# EasyEDA Pro project Secuenciador.eprj

# Schematic MAIN
Board Name: Board1; Create Date: 2025-08-13; Page Name: P1; Project Name: Secuenciador; Schematic Name: MAIN; Update Date: 2025-08-21; Company: EasyEDA.com; Page Size: A4; Version: V1.0
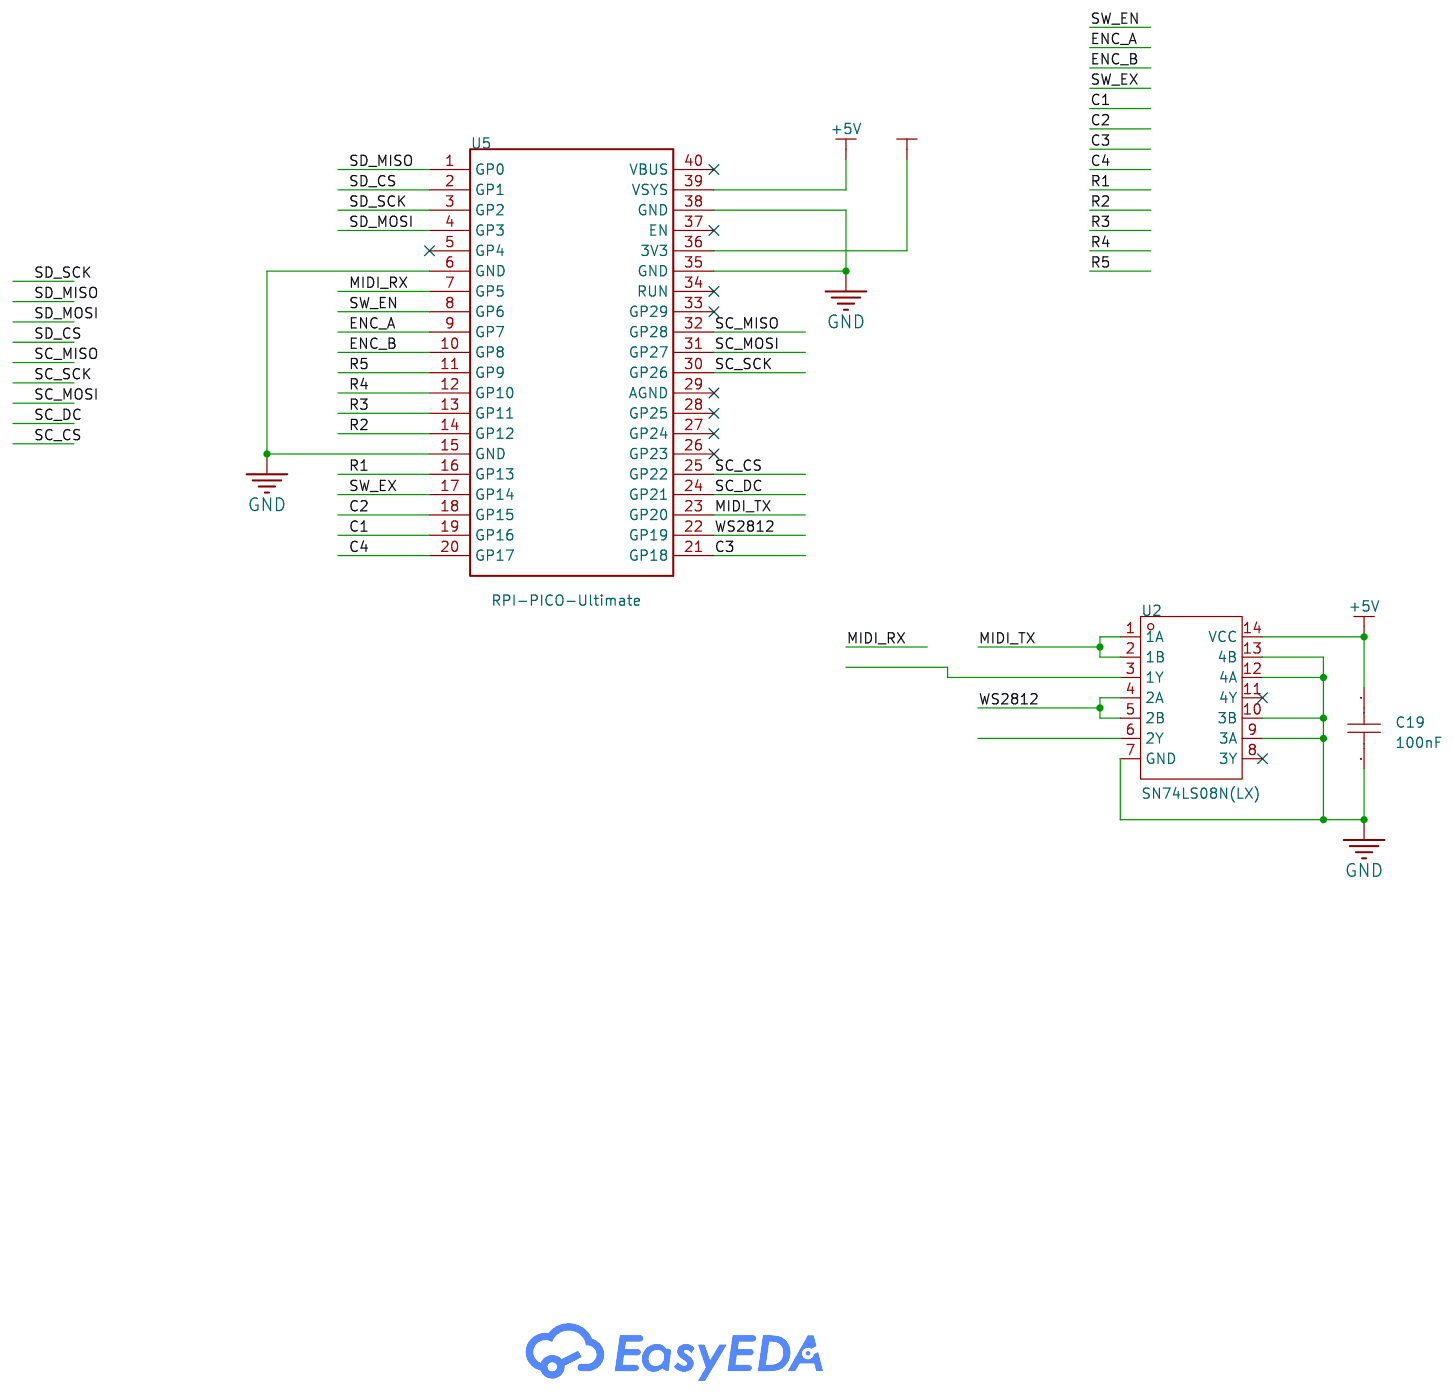
[diagram p0: schematic sheet]

## Parts
C19  100nF  [C0805]
CBB1  -
CBB2  -
CBB3  -
CBB4  -
U2  SN74LS08N(LX)  [DIP-14_L19.1-W6.4-P2.54-LS7.6-BL]
U5  RPI-PICO-Ultimate  [RP-Pico-Ultimate-FP]

## Library data of the parts
C19 = C0805B104K500NT: LCSC Part Name: 100nF ±10% 50V; Supplier Part: C476766; Manufacturer: TORCH(火炬); Supplier Footprint: 0805; JLCPCB Part Class: Extended Part; Datasheet: https://atta.szlcsc.com/upload/public/pdf/source/20191230/C476766_171E30D5B7F7164A8210B8E948DFBAE0.pdf; Supplier: LCSC; Tolerance: ±10%; Voltage Rating: 50V; Temperature Coefficient: X7R
U2 = SN74LS08N(LX): LCSC Part Name: 集成电路; Supplier Part: C22384768; Manufacturer: LX(灵星芯微); Supplier Footprint: DIP-14; JLCPCB Part Class: Extended Part; Datasheet: https://item.szlcsc.com/datasheet/SN74LS08N(LX)/23931745.html; Supplier: LCSC; Logic Type: AND Gate; Number of Channels: 4; Voltage - Supply: 2V~6V; Quiescent Current: 2uA; Current - Output Low(IOL): 5.2mA; Current - Output High(IOH): 5.2mA; Input Logic Level - High: 1.5V~4.2V; Input Logic Level - Low: 500mV~1.8V; Series: 74LS Series; Propagation Delay: 15ns@6V; Operating Temperature: -40℃~+125℃
U5 = RPI-PICO-Ultimate: Manufacturer: Raspberry Pi Foundation; Mounting Technology: SMT; Supplier: DigiKey; Supplier Part No: 2648-SC0915CT-ND; Supplier Link: https://www.digikey.com/en/products/detail/raspberry-pi/SC0915/13684020; Manufacturer Part No: SC0915

## Nets
+3V3RP: U5.36(3V3)
+5V: C19.1 U2.14(VCC) U5.39(VSYS)
GND: C19.2 U2.7(GND) U2.9(3A) U2.10(3B) U2.12(4A) U2.13(4B) U5.6(GND) U5.15(GND) U5.35(GND) U5.38(GND)
C1: CBB1.(SW_EX) U5.8(GP6) U5.9(GP7) U5.10(GP8) U5.11(GP9) U5.12(GP10) U5.13(GP11) U5.14(GP12) U5.16(GP13) U5.17(GP14) U5.18(GP15) U5.19(GP16) U5.20(GP17) U5.21(GP18)
MIDI_RX: CBB4.(MIDI_RX) U2.3(1Y) U5.7(GP5)
MIDI_TX: U2.1(1A) U2.2(1B) U5.23(GP20)
SC_CS: CBB3.(SD_SCK) U5.1(GP0) U5.2(GP1) U5.3(GP2) U5.4(GP3) U5.24(GP21) U5.25(GP22) U5.30(GP26) U5.31(GP27) U5.32(GP28)
WS2812: U2.4(2A) U2.5(2B) U5.22(GP19)
Net-(CBB2-): CBB2.(WS2812) U2.6(2Y)

Not connected (* = marked no-connect by the designer): U2 8(3Y)* 11(4Y)*; U5 5(GP4)* 26(GP23)* 27(GP24)* 28(GP25)* 29(AGND)* 33(GP29)* 34(RUN)* 37(EN)* 40(VBUS)*

# Schematic MIDI
Create Date: 2025-08-13; Page Name: P1; Project Name: Secuenciador; Schematic Name: MIDI; Update Date: 2025-08-22; Company: EasyEDA.com; Page Size: A4; Version: V1.0
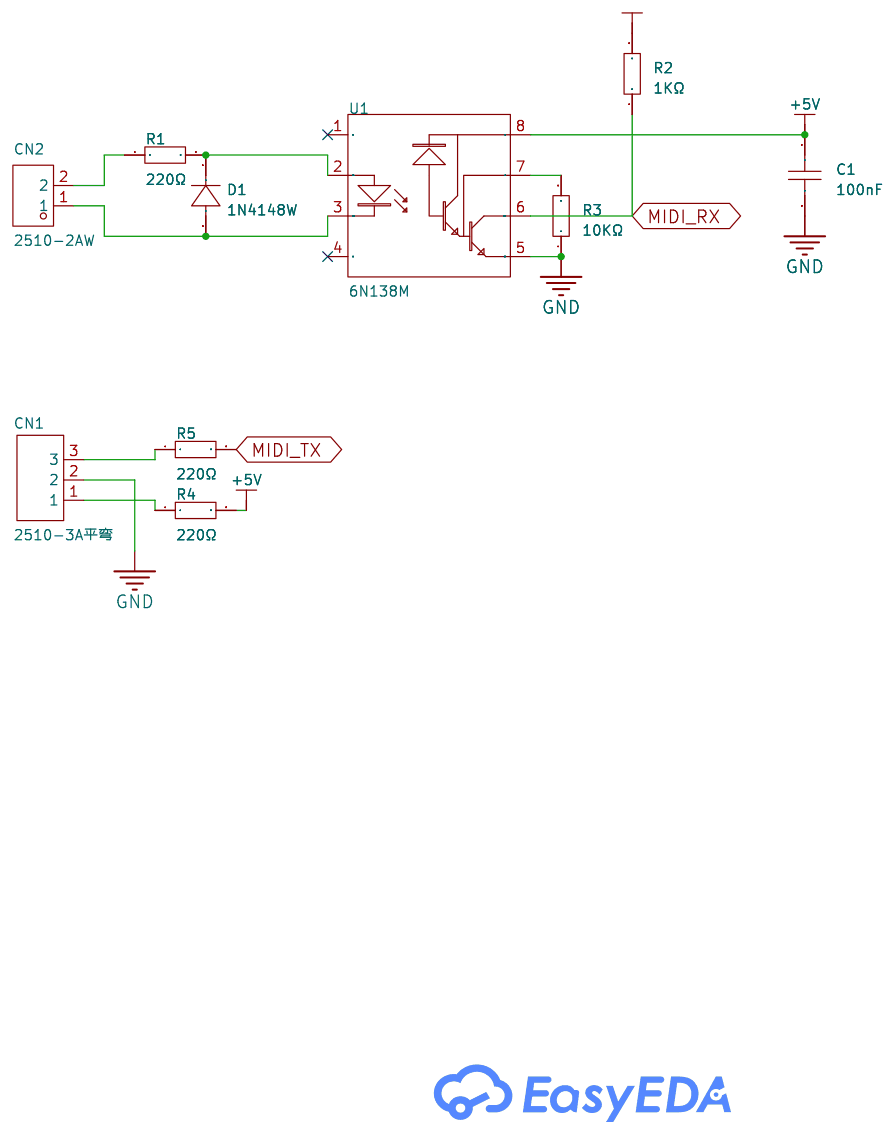
[diagram p1: schematic sheet]

## Parts
C1  100nF  [C0805]
CN1  2510-3A平弯  [CONN-TH_KF2510-3AW]
CN2  2510-2AW  [CONN-TH_2510-2AW]
D1  1N4148W  [SOD-123_L2.8-W1.8-LS3.7-RD-1]
R1  220Ω  [R1210]
R2  1KΩ  [R1210]
R3  10KΩ  [R1210]
R4  220Ω  [R1210]
R5  220Ω  [R1210]
U1  6N138M  [DIP-8_L9.8-W6.6-P2.54-LS7.6-BL]

## Library data of the parts
C1 = CAP_0805: Supplier Footprint: 0805
CN1 = 2510-3A平弯_C45011: LCSC Part Name: 1x3P 间距:2.54mm 弯插 系列:KK 254(MX2510); Supplier Part: C45011; Manufacturer: BOOMELE(博穆精密); Supplier Footprint: 弯插,P=2.54mm; JLCPCB Part Class: Extended Part; Datasheet: https://item.szlcsc.com/datasheet/2510-3A%25E5%25B9%25B3%25E5%25BC%25AF/46013.html; Supplier: LCSC; Pins Structure: 1x3P; Pitch: 2.54mm; Mounting Type: Right Angle; Reference Series: KK 254(MX2510); Number of Pins: 3P; Number of Rows: 1; Number of PINs Per Row: 3
CN2 = 2510-2AW: LCSC Part Name: 1x2P 间距:2.54mm 弯插; Supplier Part: C722717; Manufacturer: CAX(创都); Supplier Footprint: 弯插,P=2.54mm; JLCPCB Part Class: Extended Part; Datasheet: https://item.szlcsc.com/datasheet/2510-2AW/766924.html; Supplier: LCSC; Pins Structure: 1x2P; Pitch: 2.54mm; Mounting Type: Right Angle; Number of Pins: 2P; Number of Rows: 1; Number of PINs Per Row: 2; Current Rating: 3A; Operating Temperature: -25℃~+85℃
D1 = 1N4148W_C917030: Supplier Part: C917030; Manufacturer: JSMSEMI(杰盛微); Supplier Footprint: SOD-123; JLCPCB Part Class: Extended Part; Datasheet: https://item.szlcsc.com/datasheet/1N4148W/991526.html; Supplier: LCSC; Diode Configuration: Independent; Voltage - Forward(Vf@If): 1.25V@150mA; Voltage - DC Reverse(Vr): 100V; Current - Rectified: 300mA; Pd - Power Dissipation: 400mW; Reverse Leakage Current (Ir): 1uA@75V; Reverse Recovery Time (trr): 8ns; Operating Junction Temperature Range: -55℃~+150℃@(Tj); Non-Repetitive Peak Forward Surge Current: 4A
R1-R5 = Res_1210: Supplier Footprint: 1210
U1 = 6N138M: Supplier Part: C3001991; Manufacturer: UMW(友台半导体); Supplier Footprint: DIP-8; JLCPCB Part Class: Extended Part; Datasheet: https://item.szlcsc.com/datasheet/6N138M/3486698.html; Supplier: LCSC; Input Type: DC; Voltage - Supply: -500mV~18V; Isolation Voltage(Vrms): 5kV; CMTI(kV/us): 1kV/us; Current transfer ratio: 300%; Number of Channels: 1; Operating Temperature: -55℃~+100℃; Low level Delay Time: 35us; High level Delay Time: 15us; Output current: 60mA; power dissipation: 200mW; Output voltage: 18V; Voltage - Forward(Vf): 1.28V

## Nets
+3V3RP: R2.2
+5V: C1.1 R4.2 U1.8(VCC)
GND: C1.2 CN1.2 R3.1 U1.5(EMITTER)
MIDI_RX: R2.1 U1.6(COLLECTOR)
MIDI_TX: R5.2
Net-(CN1-1): CN1.1 R4.1
Net-(CN1-3): CN1.3 R5.1
Net-(CN2-1): CN2.1 D1.2(A) U1.3(CATHODE)
Net-(CN2-2): CN2.2 R1.1
Net-(D1-1): D1.1(C) R1.2 U1.2(ANODE)
Net-(R3-2): R3.2 U1.7(VB)

Not connected (* = marked no-connect by the designer): U1 1(NC)* 4(NC)*

# Schematic INPUT
Create Date: 2025-08-13; Page Name: P1; Project Name: Secuenciador; Schematic Name: INPUT; Update Date: 2025-08-15; Company: EasyEDA.com; Page Size: A4; Version: V1.0
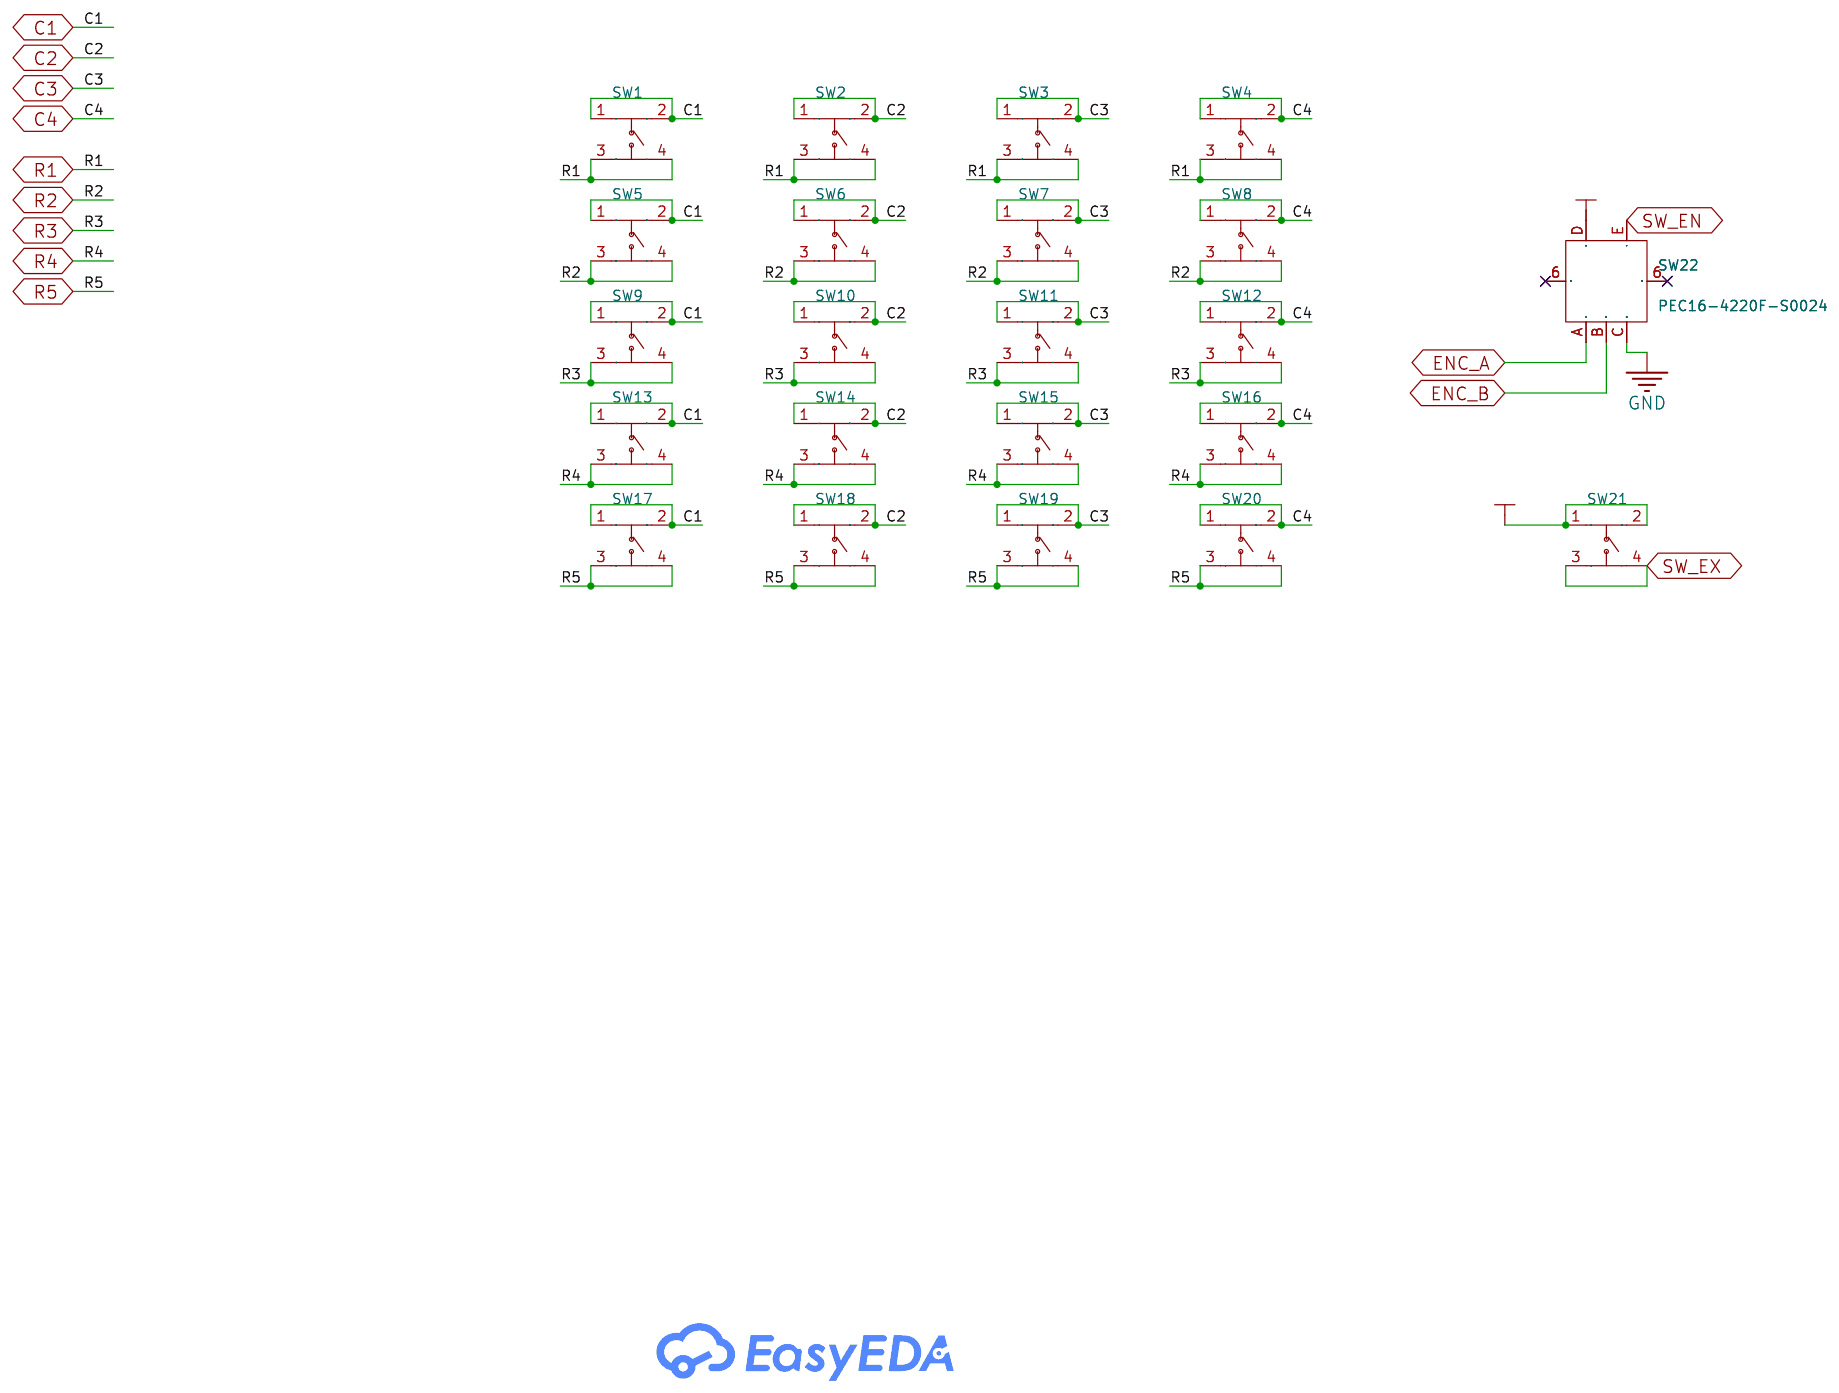
[diagram p2: schematic sheet]

## Parts
SW1  K2-1103DP-Y4SW-04  [KEY-TH_4P-L12.0-W12.0-P5.00-LS12.5]
SW2  K2-1103DP-Y4SW-04  [KEY-TH_4P-L12.0-W12.0-P5.00-LS12.5]
SW3  K2-1103DP-Y4SW-04  [KEY-TH_4P-L12.0-W12.0-P5.00-LS12.5]
SW4  K2-1103DP-Y4SW-04  [KEY-TH_4P-L12.0-W12.0-P5.00-LS12.5]
SW5  K2-1103DP-Y4SW-04  [KEY-TH_4P-L12.0-W12.0-P5.00-LS12.5]
SW6  K2-1103DP-Y4SW-04  [KEY-TH_4P-L12.0-W12.0-P5.00-LS12.5]
SW7  K2-1103DP-Y4SW-04  [KEY-TH_4P-L12.0-W12.0-P5.00-LS12.5]
SW8  K2-1103DP-Y4SW-04  [KEY-TH_4P-L12.0-W12.0-P5.00-LS12.5]
SW9  K2-1103DP-Y4SW-04  [KEY-TH_4P-L12.0-W12.0-P5.00-LS12.5]
SW10  K2-1103DP-Y4SW-04  [KEY-TH_4P-L12.0-W12.0-P5.00-LS12.5]
SW11  K2-1103DP-Y4SW-04  [KEY-TH_4P-L12.0-W12.0-P5.00-LS12.5]
SW12  K2-1103DP-Y4SW-04  [KEY-TH_4P-L12.0-W12.0-P5.00-LS12.5]
SW13  K2-1103DP-Y4SW-04  [KEY-TH_4P-L12.0-W12.0-P5.00-LS12.5]
SW14  K2-1103DP-Y4SW-04  [KEY-TH_4P-L12.0-W12.0-P5.00-LS12.5]
SW15  K2-1103DP-Y4SW-04  [KEY-TH_4P-L12.0-W12.0-P5.00-LS12.5]
SW16  K2-1103DP-Y4SW-04  [KEY-TH_4P-L12.0-W12.0-P5.00-LS12.5]
SW17  K2-1103DP-Y4SW-04  [KEY-TH_4P-L12.0-W12.0-P5.00-LS12.5]
SW18  K2-1103DP-Y4SW-04  [KEY-TH_4P-L12.0-W12.0-P5.00-LS12.5]
SW19  K2-1103DP-Y4SW-04  [KEY-TH_4P-L12.0-W12.0-P5.00-LS12.5]
SW20  K2-1103DP-Y4SW-04  [KEY-TH_4P-L12.0-W12.0-P5.00-LS12.5]
SW21  K2-1103DP-Y4SW-04  [KEY-TH_4P-L12.0-W12.0-P5.00-LS12.5]
SW22  PEC16-4220F-S0024  [SW-SMD_PEC16-4220F-S0024]

## Library data of the parts
SW1-SW21 = K2-1103DP-Y4SW-04: LCSC Part Name: 12x12x18插件开关; Supplier Part: C2909667; Manufacturer: 韩国韩荣; Supplier Footprint: 插件; JLCPCB Part Class: Extended Part; Datasheet: https://atta.szlcsc.com/upload/public/pdf/source/20211126/1EEB0C2A8EBA15EDA0FBF5A1B503683D.pdf; Supplier: LCSC; Actuator Style: Round Button; Operating Force: 250gf; Mounting Style: Straight; Switch Length: 12mm; Switch Width: 12mm; Switch Height: 17mm; Contact Current: 50mA; Voltage Rating (DC): 12V; Insulation Resistance: 100MΩ; Mechanical Life: 10万次; Operating Temperature: -25℃~+85℃
SW22 = PEC16-4220F-S0024: LCSC Part Name: 三件套 PEC16-4220F-S0024（三件套）; Supplier Part: C143796; Manufacturer: BOURNS; Supplier Footprint: 插件; JLCPCB Part Class: Extended Part; Datasheet: https://item.szlcsc.com/datasheet/PEC16-4220F-S0024/155127.html; Supplier: LCSC

## Nets
+3V3RP: SW21.1 SW21.2 SW22.D
GND: SW22.C
C1: SW1.1 SW1.2 SW5.1 SW5.2 SW9.1 SW9.2 SW13.1 SW13.2 SW17.1 SW17.2
C2: SW2.1 SW2.2 SW6.1 SW6.2 SW10.1 SW10.2 SW14.1 SW14.2 SW18.1 SW18.2
C3: SW3.1 SW3.2 SW7.1 SW7.2 SW11.1 SW11.2 SW15.1 SW15.2 SW19.1 SW19.2
C4: SW4.1 SW4.2 SW8.1 SW8.2 SW12.1 SW12.2 SW16.1 SW16.2 SW20.1 SW20.2
ENC_A: SW22.A
ENC_B: SW22.B
R1: SW1.3 SW1.4 SW2.3 SW2.4 SW3.3 SW3.4 SW4.3 SW4.4
R2: SW5.3 SW5.4 SW6.3 SW6.4 SW7.3 SW7.4 SW8.3 SW8.4
R3: SW9.3 SW9.4 SW10.3 SW10.4 SW11.3 SW11.4 SW12.3 SW12.4
R4: SW13.3 SW13.4 SW14.3 SW14.4 SW15.3 SW15.4 SW16.3 SW16.4
R5: SW17.3 SW17.4 SW18.3 SW18.4 SW19.3 SW19.4 SW20.3 SW20.4
SW_EN: SW22.E
SW_EX: SW21.3 SW21.4

Not connected (* = marked no-connect by the designer): SW22 6*

# Schematic OUTPUT
Create Date: 2025-08-13; Page Name: P1; Project Name: Secuenciador; Schematic Name: OUTPUT; Update Date: 2025-08-14; Company: EasyEDA.com; Page Size: A4; Version: V1.0
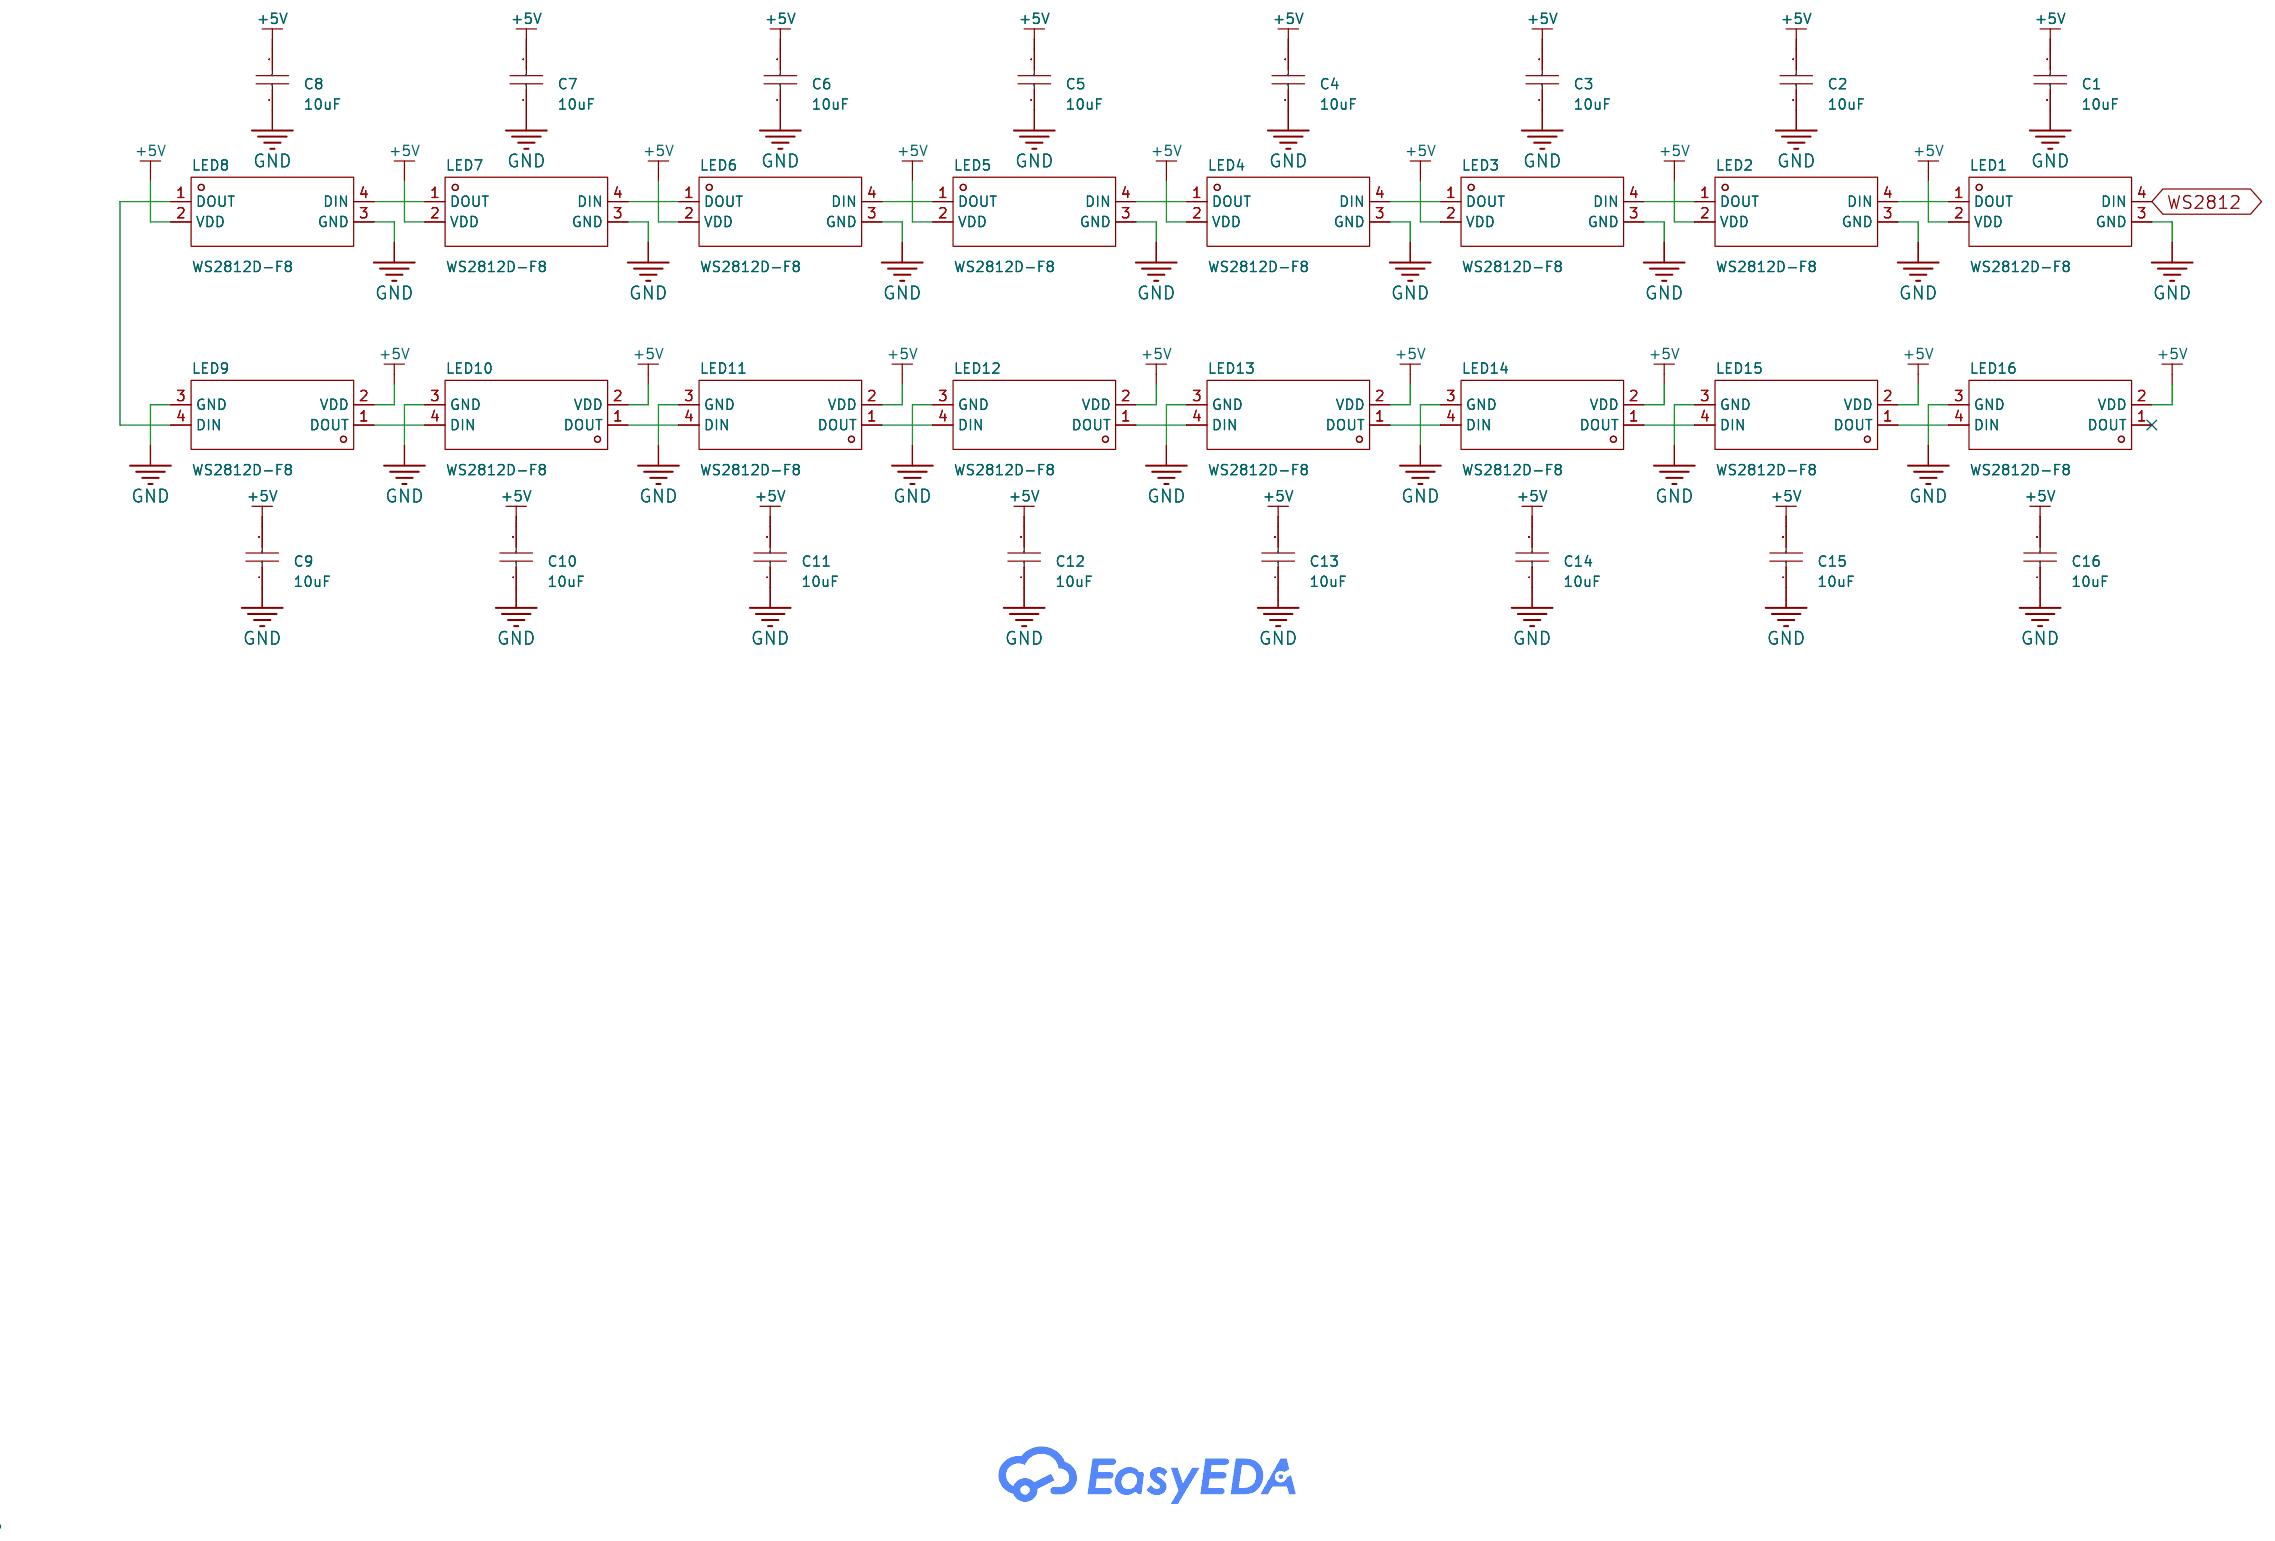
[diagram p3: schematic sheet]

## Parts
C1  10uF  [C1210]
C2  10uF  [C1210]
C3  10uF  [C1210]
C4  10uF  [C1210]
C5  10uF  [C1210]
C6  10uF  [C1210]
C7  10uF  [C1210]
C8  10uF  [C1210]
C9  10uF  [C1210]
C10  10uF  [C1210]
C11  10uF  [C1210]
C12  10uF  [C1210]
C13  10uF  [C1210]
C14  10uF  [C1210]
C15  10uF  [C1210]
C16  10uF  [C1210]
LED1  WS2812D-F8  [LED-TH_WS2812D-F8]
LED2  WS2812D-F8  [LED-TH_WS2812D-F8]
LED3  WS2812D-F8  [LED-TH_WS2812D-F8]
LED4  WS2812D-F8  [LED-TH_WS2812D-F8]
LED5  WS2812D-F8  [LED-TH_WS2812D-F8]
LED6  WS2812D-F8  [LED-TH_WS2812D-F8]
LED7  WS2812D-F8  [LED-TH_WS2812D-F8]
LED8  WS2812D-F8  [LED-TH_WS2812D-F8]
LED9  WS2812D-F8  [LED-TH_WS2812D-F8]
LED10  WS2812D-F8  [LED-TH_WS2812D-F8]
LED11  WS2812D-F8  [LED-TH_WS2812D-F8]
LED12  WS2812D-F8  [LED-TH_WS2812D-F8]
LED13  WS2812D-F8  [LED-TH_WS2812D-F8]
LED14  WS2812D-F8  [LED-TH_WS2812D-F8]
LED15  WS2812D-F8  [LED-TH_WS2812D-F8]
LED16  WS2812D-F8  [LED-TH_WS2812D-F8]

## Library data of the parts
C1-C16 = CL32B106KAJNNNE: LCSC Part Name: 10uF ±10% 25V; Supplier Part: C39232; Manufacturer: SAMSUNG(三星); Supplier Footprint: 1210; JLCPCB Part Class: Extended Part; Datasheet: https://item.szlcsc.com/datasheet/CL32B106KAJNNNE/40215.html; Supplier: LCSC; Tolerance: ±10%; Voltage Rating: 25V; Temperature Coefficient: X7R
LED1-LED16 = WS2812D-F8: LCSC Part Name: RGB三色; Supplier Part: C139126; Manufacturer: worldsemi; Supplier Footprint: 插件,D=8mm; JLCPCB Part Class: Extended Part; Datasheet: https://atta.szlcsc.com/upload/public/pdf/source/20171116/C139126_15108221280701123735.pdf; Supplier: LCSC

## Nets
+5V: C1.2 C2.2 C3.2 C4.2 C5.2 C6.2 C7.2 C8.2 C9.2 C10.2 C11.2 C12.2 C13.2 C14.2 C15.2 C16.2 LED1.2(VDD) LED2.2(VDD) LED3.2(VDD) LED4.2(VDD) LED5.2(VDD) LED6.2(VDD) LED7.2(VDD) LED8.2(VDD) LED9.2(VDD) LED10.2(VDD) LED11.2(VDD) LED12.2(VDD) LED13.2(VDD) LED14.2(VDD) LED15.2(VDD) LED16.2(VDD)
GND: C1.1 C2.1 C3.1 C4.1 C5.1 C6.1 C7.1 C8.1 C9.1 C10.1 C11.1 C12.1 C13.1 C14.1 C15.1 C16.1 LED1.3(GND) LED2.3(GND) LED3.3(GND) LED4.3(GND) LED5.3(GND) LED6.3(GND) LED7.3(GND) LED8.3(GND) LED9.3(GND) LED10.3(GND) LED11.3(GND) LED12.3(GND) LED13.3(GND) LED14.3(GND) LED15.3(GND) LED16.3(GND)
WS2812: LED1.4(DIN)
Net-(LED1-1): LED1.1(DOUT) LED2.4(DIN)
Net-(LED2-1): LED2.1(DOUT) LED3.4(DIN)
Net-(LED3-1): LED3.1(DOUT) LED4.4(DIN)
Net-(LED4-1): LED4.1(DOUT) LED5.4(DIN)
Net-(LED5-1): LED5.1(DOUT) LED6.4(DIN)
Net-(LED6-1): LED6.1(DOUT) LED7.4(DIN)
Net-(LED7-1): LED7.1(DOUT) LED8.4(DIN)
Net-(LED8-1): LED8.1(DOUT) LED9.4(DIN)
Net-(LED9-1): LED9.1(DOUT) LED10.4(DIN)
Net-(LED10-1): LED10.1(DOUT) LED11.4(DIN)
Net-(LED11-1): LED11.1(DOUT) LED12.4(DIN)
Net-(LED12-1): LED12.1(DOUT) LED13.4(DIN)
Net-(LED13-1): LED13.1(DOUT) LED14.4(DIN)
Net-(LED14-1): LED14.1(DOUT) LED15.4(DIN)
Net-(LED15-1): LED15.1(DOUT) LED16.4(DIN)

Not connected (* = marked no-connect by the designer): LED16 1(DOUT)*

# Schematic PERIPHERALS
Create Date: 2025-08-14; Page Name: P1; Project Name: Secuenciador; Schematic Name: PERIPHERALS; Update Date: 2025-08-21; Company: EasyEDA.com; Page Size: A4; Version: V1.0
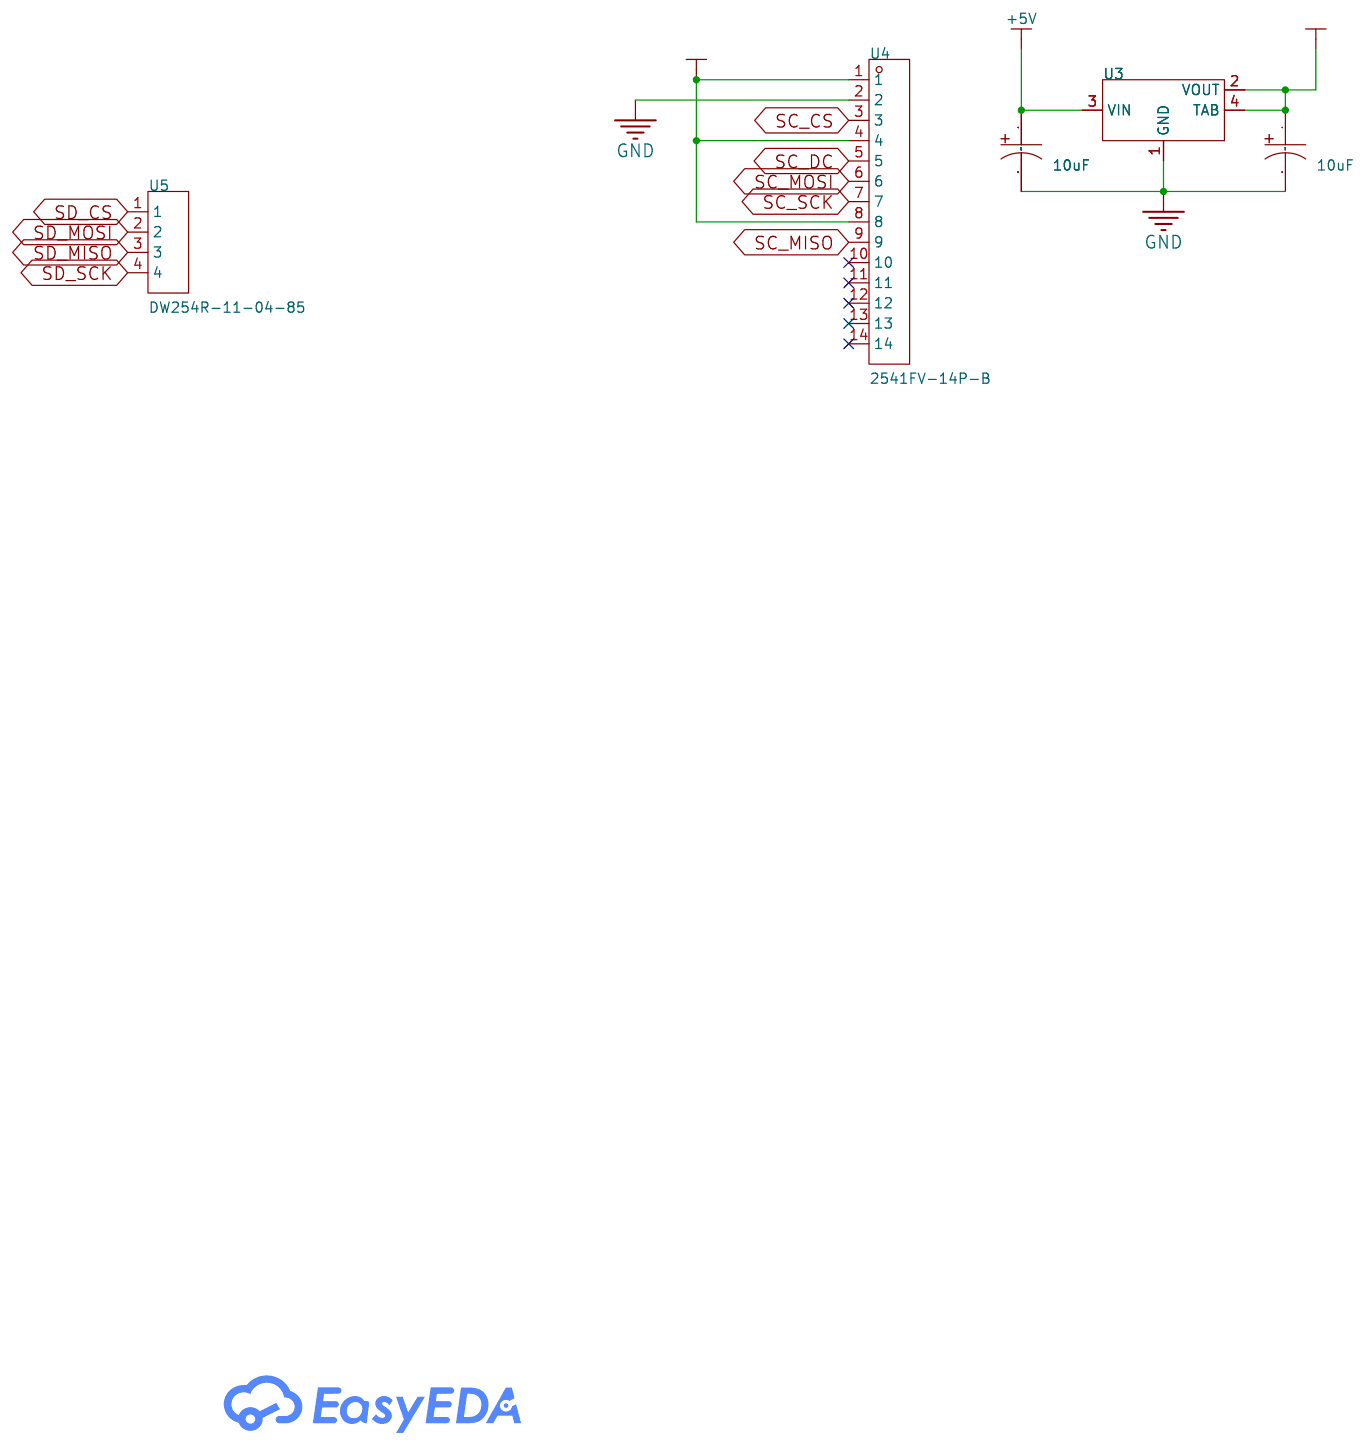
[diagram p4: schematic sheet]

## Parts
C?#1  10uF  [CAP-SMD_BD5.0-L5.3-W5.3-FD]
C?#2  10uF  [CAP-SMD_BD5.0-L5.3-W5.3-FD]
U3  -  [SOT-223-4_L6.5-W3.5-P2.30-LS7.0-BR]
U4  2541FV-14P-B  [HDR-TH_14P-P2.54-V-F]
U5  DW254R-11-04-85  [HDR-TH_4P-P2.54-V-F]

## Library data of the parts
C?#1 C?#2 = VES100M1HTR-0505: LCSC Part Name: 10uF ±20% 50V; Supplier Part: C176662; Manufacturer: Lelon(立隆); Supplier Footprint: SMD,D5xL5.3mm; JLCPCB Part Class: Extended Part; Datasheet: https://item.szlcsc.com/datasheet/VES100M1HTR-0505/188052.html; Supplier: LCSC; Tolerance: ±20%; Voltage Rating: 50V; Diameter: 5mm; Height - Seated (Max): 5.3mm; Lifetime: 1000hrs@105℃; Operating Temperature: -45℃~+105℃
U3 = AMS1117-3.3V: Supplier Footprint: SOT-223
U4 = 2541FV-14P-B: LCSC Part Name: 1x14P 间距:2.54mm 直插; Supplier Part: C25503120; Manufacturer: HanElectricity(瀚源); Supplier Footprint: 插件,P=2.54mm; JLCPCB Part Class: Extended Part; Datasheet: https://atta.szlcsc.com/upload/public/pdf/source/20240704/2CCE49895ED08C95E19327B953741130.pdf; Supplier: LCSC; Holes Structure: 1x14P; Pitch: 2.54mm; Row Spacing: 2.54mm; Circular Hole / Square Hole: Square Hole; Mounting Type: Through Hole; Number of Rows: 1; Number of Positions: 14P; Current Rating: 3A; Holes Direction: Top; Operating Temperature: -40℃~+105℃
U5 = DW254R-11-04-85: LCSC Part Name: 间距:2.54mm 1x4P 直插; Supplier Part: C2935898; Manufacturer: DEALON(德艺隆); Supplier Footprint: 插件,P=2.54mm; JLCPCB Part Class: Extended Part; Datasheet: https://atta.szlcsc.com/upload/public/pdf/source/20211231/7A8349F4557979E2F6F32A01D0D43AC4.pdf; Supplier: LCSC; Holes Structure: 1x4P; Pitch: 2.54mm; Circular Hole / Square Hole: Square Hole; Mounting Type: Through Hole; Number of Rows: 1; Number of Positions: 4P; Current Rating: 3A; Holes Direction: Top; Insulation Height: 8.5mm

## Nets
+3V3REG: C?#2.1 U3.2(VOUT) U3.4(TAB) U4.1 U4.4 U4.8
+5V: C?#1.1 U3.3(VIN)
GND: C?#1.2 C?#2.2 U3.1(GND) U4.2
SC_CS: U4.3
SC_DC: U4.5
SC_MISO: U4.9
SC_MOSI: U4.6
SC_SCK: U4.7
SD_CS: U5.1
SD_MISO: U5.3
SD_MOSI: U5.2
SD_SCK: U5.4

Not connected (* = marked no-connect by the designer): U4 10* 11* 12* 13* 14*

# Board PCB1
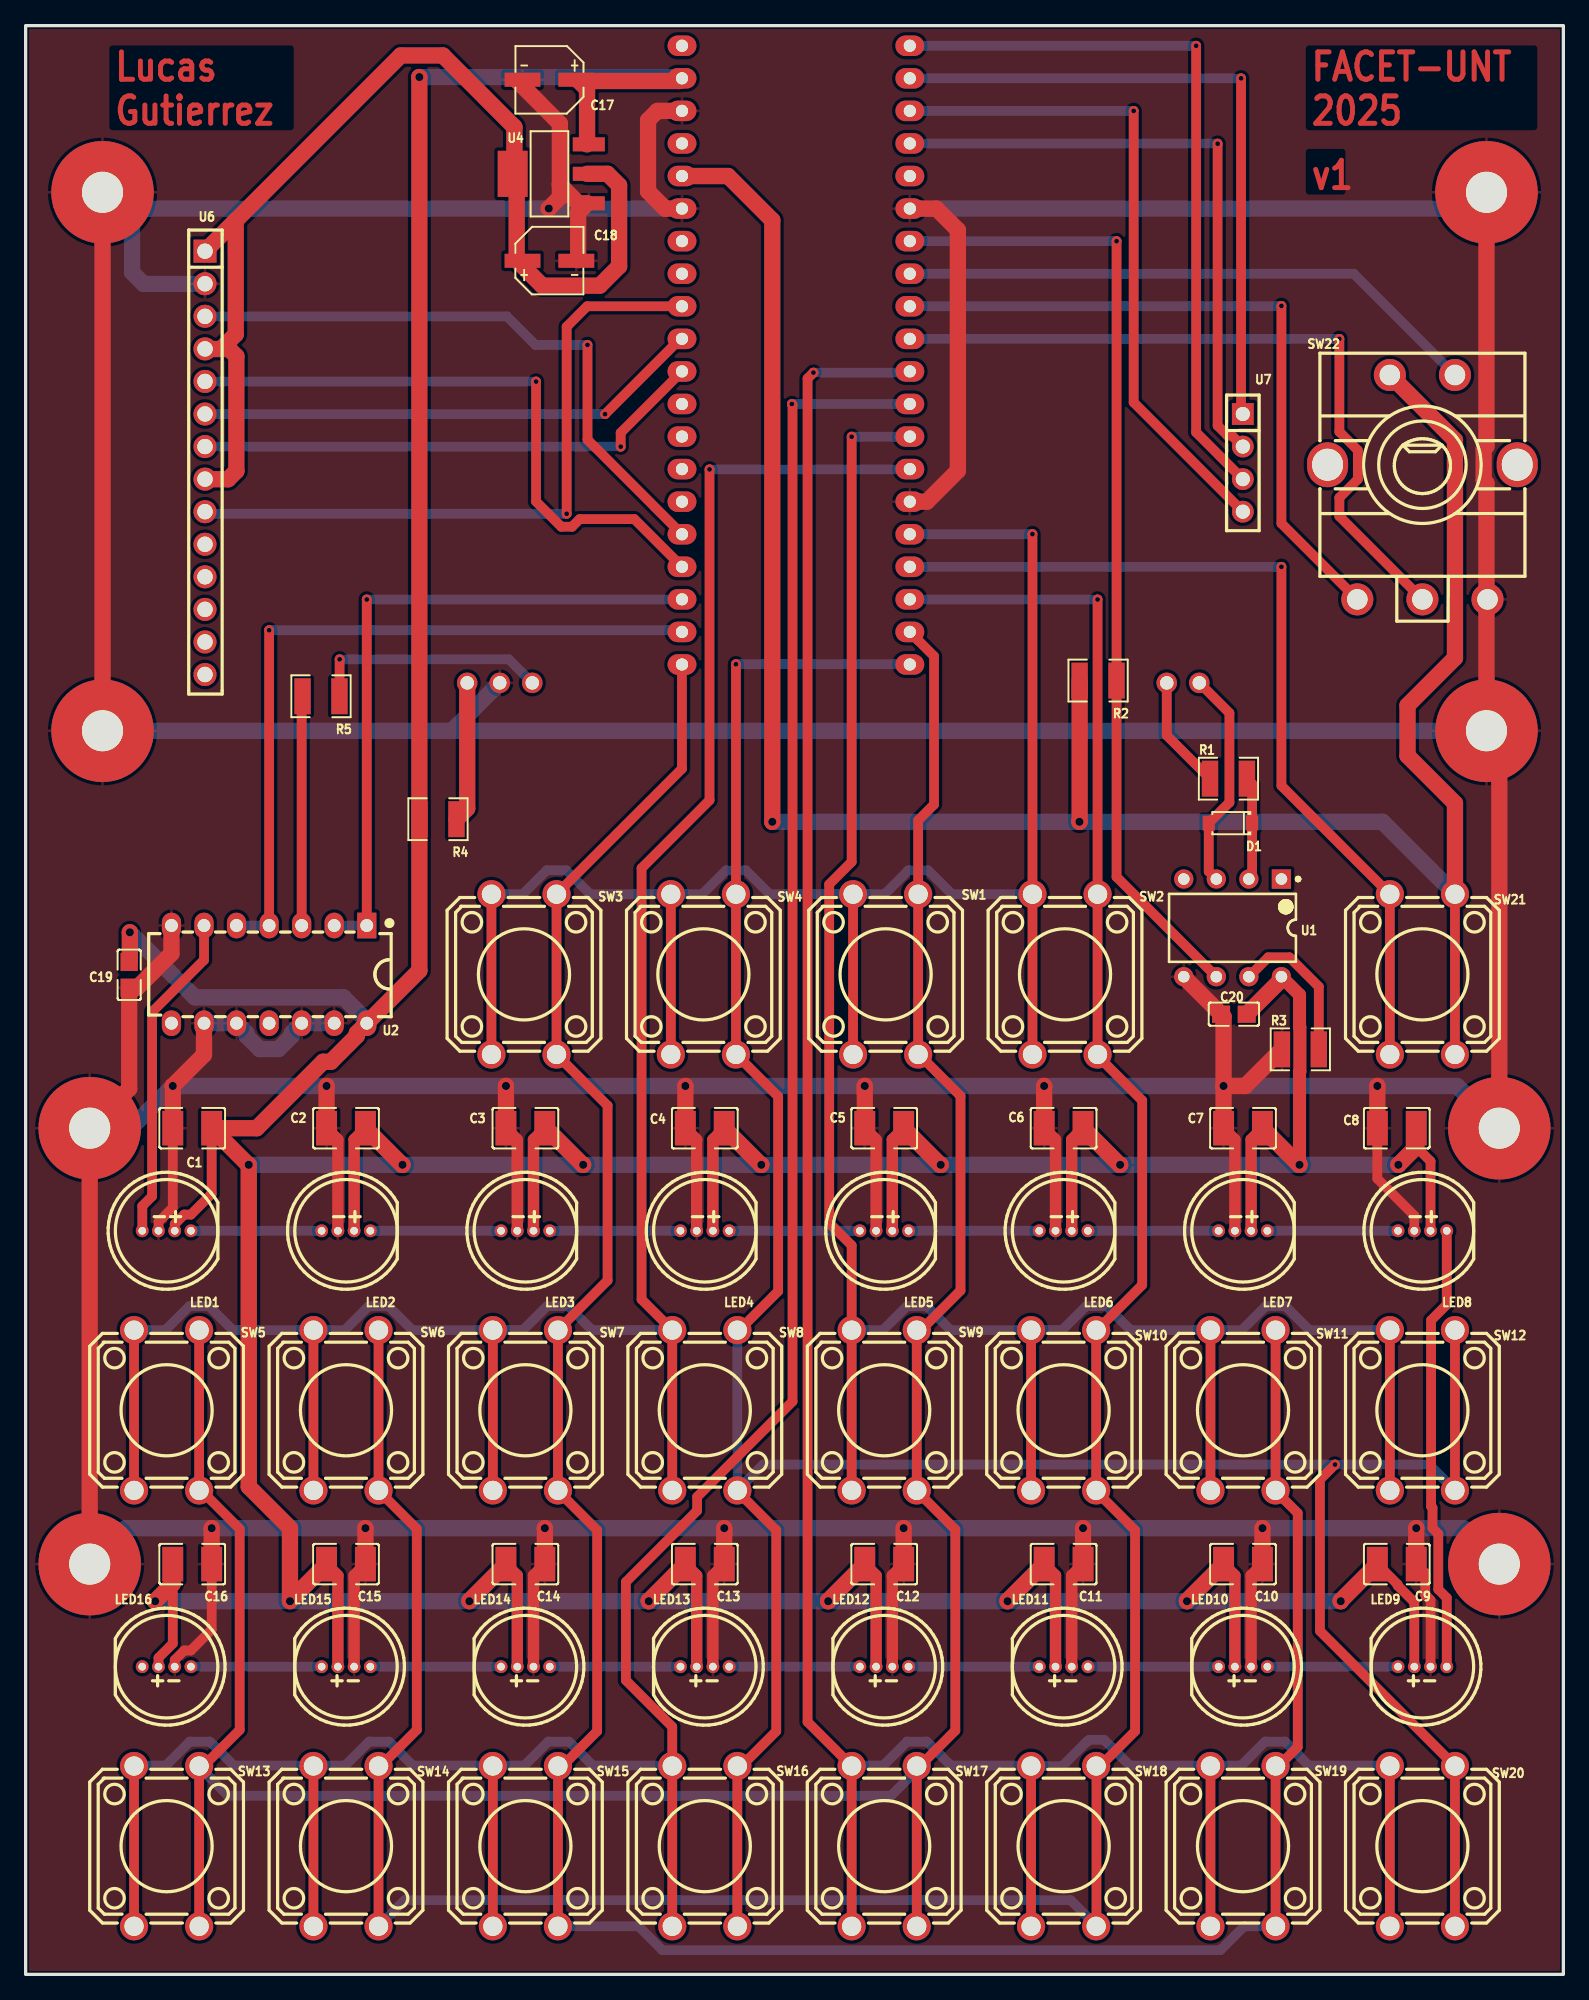
[diagram p5: board, top side]
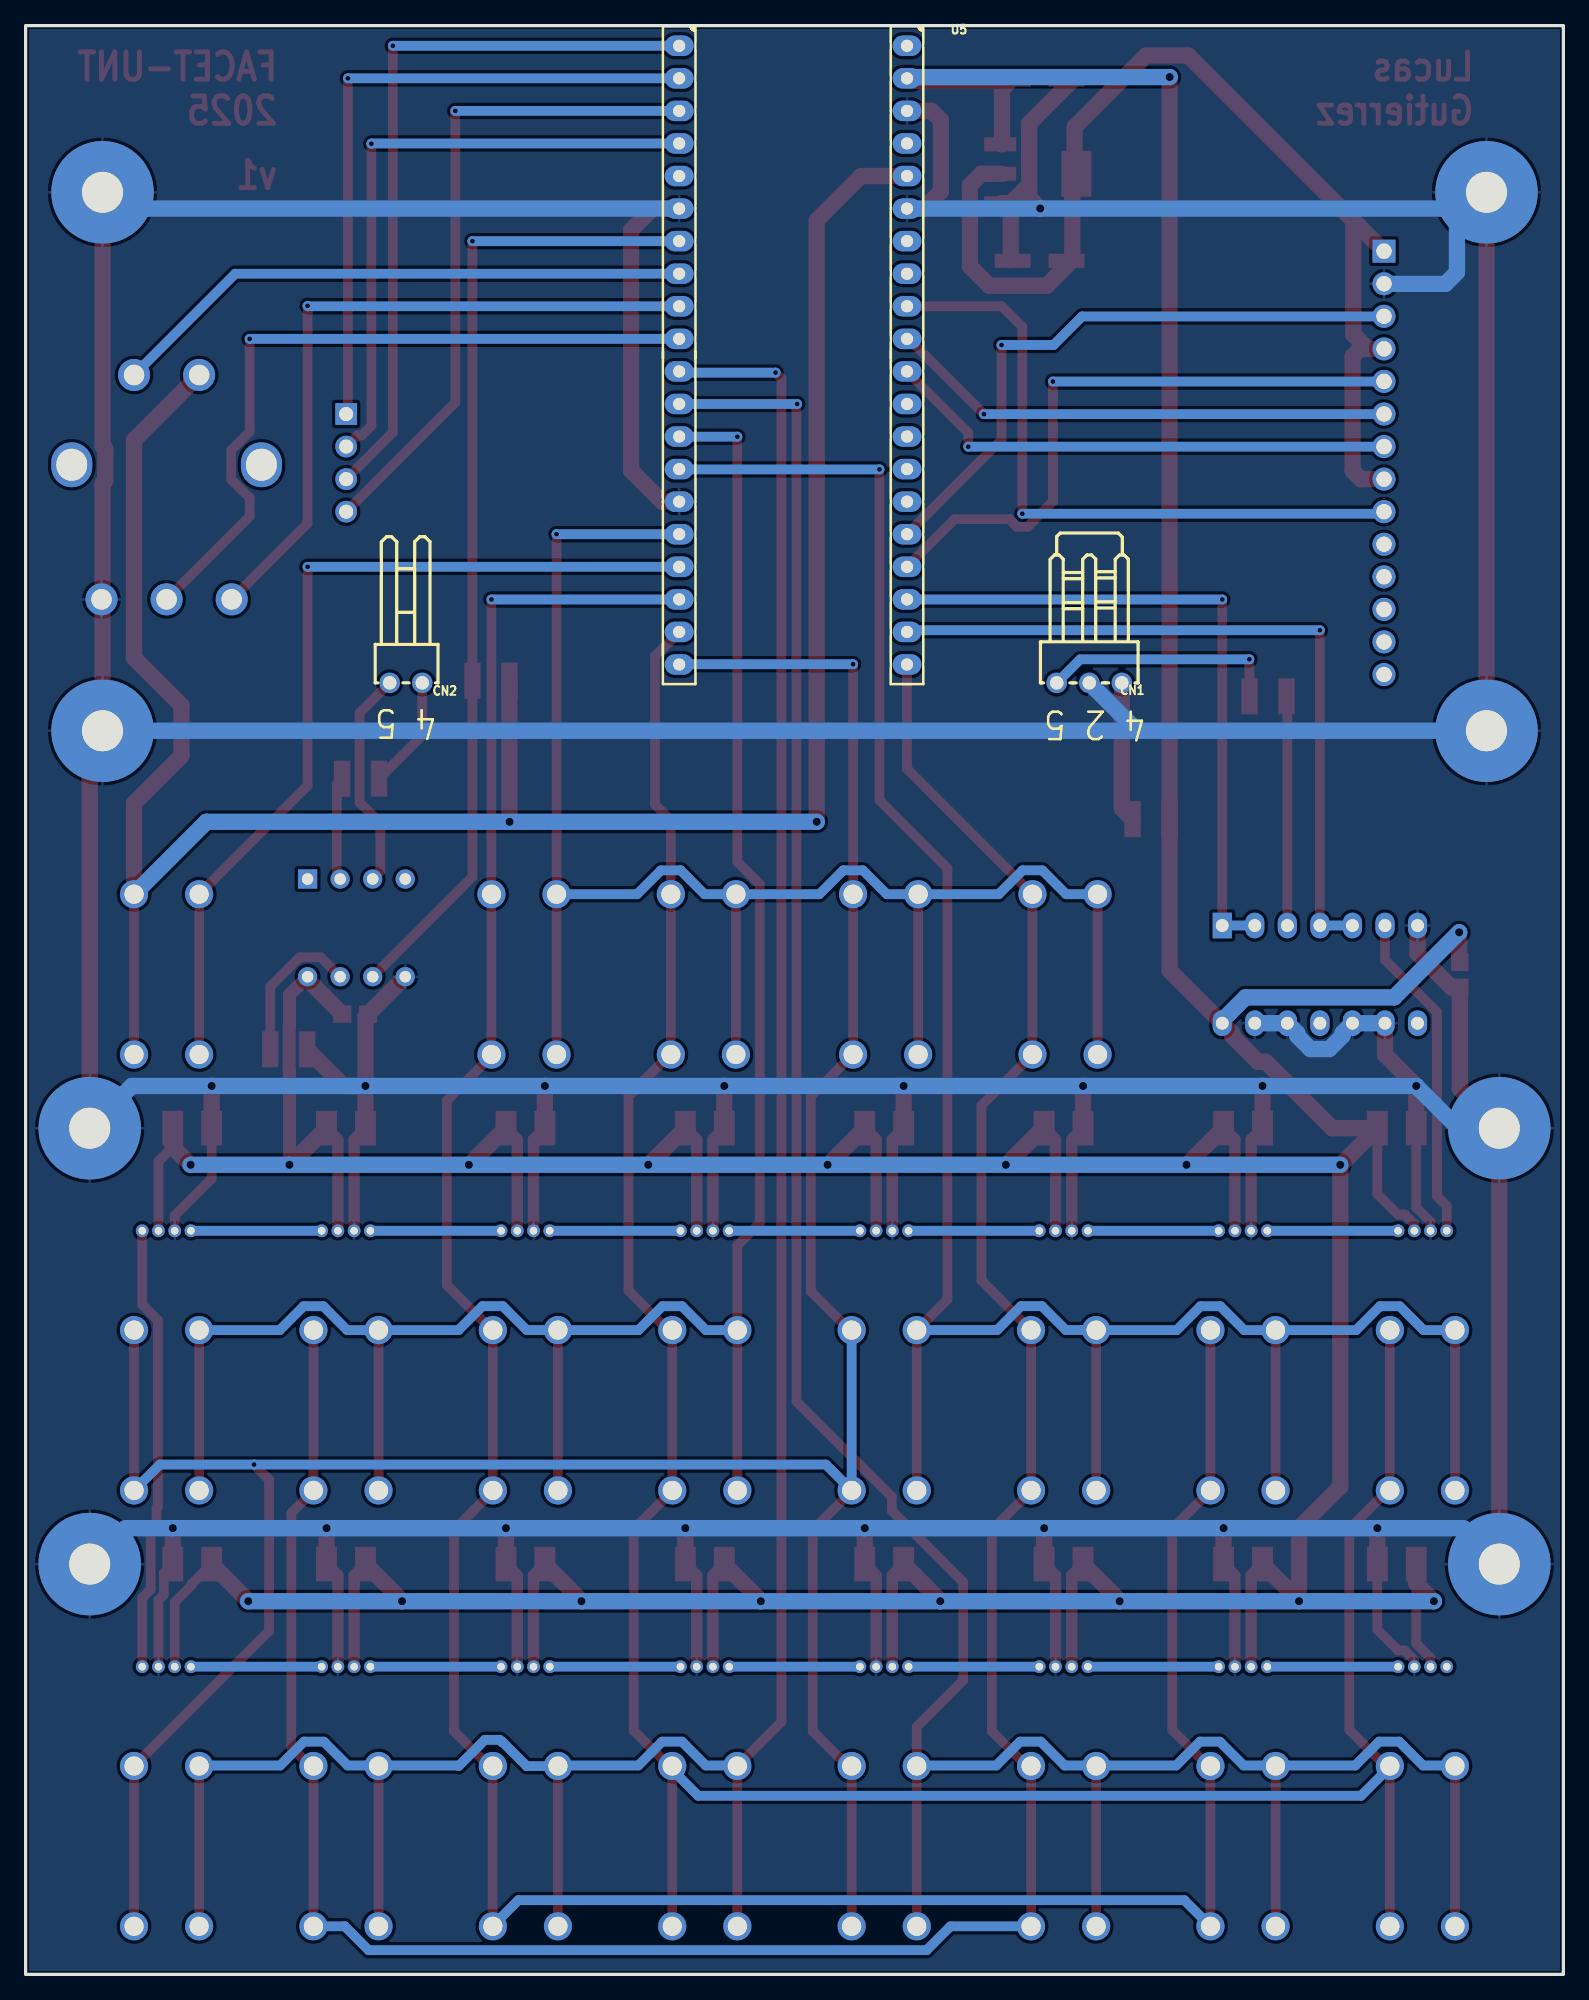
[diagram p6: board, bottom side, seen from below]

Outline 120 x 152 mm; copper layers: Top Layer, Bottom Layer. Coordinates in mm from the lower left corner of the outline.
Outline path: rectangle 0,152 120,0
Stack: Top Layer 0.035mm / Dielectric1 1.51mm FR4 er 4.5 / Bottom Layer 0.035mm

## Design rules (mm)
template: Custom Config
spacing copperThickness1oz (default): track to track 0.254, other pairs 0.152 to 0.323
spacing copperThickness2oz: track to track 0.203, other pairs 0.152 to 0.3
track width copperThickness1oz (default): min 0.127, default 0.762, max 2.54
track width copperThickness2oz: min 0.203, default 0.254, max 2.54
differential pair differentialPair (default): width min 0.127, default 0.254, max 2.54; gap min 0.152, default 0.152
via viaSize (default): diameter min 0.5, default 0.762, max 10; hole min 0.3, default 0.381, max 6.3

## Placement (name value [footprint] x y rotation side)
C1  10uF  [C1210]  13 66 0 top
C2  10uF  [C1210]  25 66 0 top
C3  10uF  [C1210]  39 66 0 top
C4  10uF  [C1210]  53 66 0 top
C5  10uF  [C1210]  67 66 0 top
C6  10uF  [C1210]  81 66 0 top
C7  10uF  [C1210]  95 66 0 top
C8  10uF  [C1210]  107 66 0 top
C9  10uF  [C1210]  107 32 180 top
C10  10uF  [C1210]  95 32 180 top
C11  10uF  [C1210]  81 32 180 top
C12  10uF  [C1210]  67 32 180 top
C13  10uF  [C1210]  53 32 180 top
C14  10uF  [C1210]  39 32 180 top
C15  10uF  [C1210]  25 32 180 top
C16  10uF  [C1210]  13 32 180 top
C17  10uF  [CAP-SMD_BD5.0-L5.3-W5.3-FD]  40.88 147.78 180 top
C18  10uF  [CAP-SMD_BD5.0-L5.3-W5.3-FD]  40.88 133.66 0 top
C19  100nF  [C0805]  8.08 77.96 270 top
C20  100nF  [C0805]  94.29 74.89 180 top
CN1  2510-3A平弯  [CONN-TH_KF2510-3AW]  37 100.74 0 bottom
CN2  2510-2AW  [CONN-TH_2510-2AW]  90.32 100.74 0 bottom
D1  1N4148W  [SOD-123_L2.8-W1.8-LS3.7-RD-1]  94.02 89.8 180 top
LED1  WS2812D-F8  [LED-TH_WS2812D-F8]  11 58 180 top
LED2  WS2812D-F8  [LED-TH_WS2812D-F8]  25 58 180 top
LED3  WS2812D-F8  [LED-TH_WS2812D-F8]  39 58 180 top
LED4  WS2812D-F8  [LED-TH_WS2812D-F8]  53 58 180 top
LED5  WS2812D-F8  [LED-TH_WS2812D-F8]  67 58 180 top
LED6  WS2812D-F8  [LED-TH_WS2812D-F8]  81 58 180 top
LED7  WS2812D-F8  [LED-TH_WS2812D-F8]  95 58 180 top
LED8  WS2812D-F8  [LED-TH_WS2812D-F8]  109 58 180 top
LED9  WS2812D-F8  [LED-TH_WS2812D-F8]  109 24 0 top
LED10  WS2812D-F8  [LED-TH_WS2812D-F8]  95 24 0 top
LED11  WS2812D-F8  [LED-TH_WS2812D-F8]  81 24 0 top
LED12  WS2812D-F8  [LED-TH_WS2812D-F8]  67 24 0 top
LED13  WS2812D-F8  [LED-TH_WS2812D-F8]  53 24 0 top
LED14  WS2812D-F8  [LED-TH_WS2812D-F8]  39 24 0 top
LED15  WS2812D-F8  [LED-TH_WS2812D-F8]  25 24 0 top
LED16  WS2812D-F8  [LED-TH_WS2812D-F8]  11 24 0 top
NOREF  -  [Pad_e65]  6 97 0 top
NOREF#2  -  [Pad_e62]  5 66 0 top
NOREF#3  -  [Pad_e61]  115 66 0 top
NOREF#4  -  [Pad_e64]  6 139 0 top
NOREF#5  -  [Pad_e67]  115 32 0 top
NOREF#6  -  [Pad_e23]  114 97 0 top
NOREF#7  -  [Pad_e68]  5 32 0 top
NOREF#8  -  [Pad_e66]  114 139 0 top
R1  220Ω  [R1210]  93.86 93.26 0 top
R2  1kΩ  [R1210]  83.69 100.92 180 top
R3  10kΩ  [R1210]  99.47 72.15 0 top
R4  220Ω  [R1210]  32.18 90.1 180 top
R5  220Ω  [R1210]  23.05 99.69 180 top
SW1  TC-1212-7.3-160G  [KEY-TH_4P-L12.0-W12.0-P5.00-LS12.5]  67.11 78 270 top
SW2  TC-1212-7.3-160G  [KEY-TH_4P-L12.0-W12.0-P5.00-LS12.5]  81.11 78 270 top
SW3  TC-1212-7.3-160G  [KEY-TH_4P-L12.0-W12.0-P5.00-LS12.5]  38.89 78 270 top
SW4  TC-1212-7.3-160G  [KEY-TH_4P-L12.0-W12.0-P5.00-LS12.5]  52.89 78 270 top
SW5  TC-1212-7.3-160G  [KEY-TH_4P-L12.0-W12.0-P5.00-LS12.5]  11 44 270 top
SW6  TC-1212-7.3-160G  [KEY-TH_4P-L12.0-W12.0-P5.00-LS12.5]  25 44 270 top
SW7  TC-1212-7.3-160G  [KEY-TH_4P-L12.0-W12.0-P5.00-LS12.5]  39 44 270 top
SW8  TC-1212-7.3-160G  [KEY-TH_4P-L12.0-W12.0-P5.00-LS12.5]  53 44 270 top
SW9  TC-1212-7.3-160G  [KEY-TH_4P-L12.0-W12.0-P5.00-LS12.5]  67 44 270 top
SW10  TC-1212-7.3-160G  [KEY-TH_4P-L12.0-W12.0-P5.00-LS12.5]  81 44 270 top
SW11  TC-1212-7.3-160G  [KEY-TH_4P-L12.0-W12.0-P5.00-LS12.5]  95 44 270 top
SW12  TC-1212-7.3-160G  [KEY-TH_4P-L12.0-W12.0-P5.00-LS12.5]  109 44 270 top
SW13  TC-1212-7.3-160G  [KEY-TH_4P-L12.0-W12.0-P5.00-LS12.5]  11 10 270 top
SW14  TC-1212-7.3-160G  [KEY-TH_4P-L12.0-W12.0-P5.00-LS12.5]  25 10 270 top
SW15  TC-1212-7.3-160G  [KEY-TH_4P-L12.0-W12.0-P5.00-LS12.5]  39 10 270 top
SW16  TC-1212-7.3-160G  [KEY-TH_4P-L12.0-W12.0-P5.00-LS12.5]  53 10 270 top
SW17  TC-1212-7.3-160G  [KEY-TH_4P-L12.0-W12.0-P5.00-LS12.5]  67 10 270 top
SW18  TC-1212-7.3-160G  [KEY-TH_4P-L12.0-W12.0-P5.00-LS12.5]  81 10 270 top
SW19  TC-1212-7.3-160G  [KEY-TH_4P-L12.0-W12.0-P5.00-LS12.5]  95 10 270 top
SW20  TC-1212-7.3-160G  [KEY-TH_4P-L12.0-W12.0-P5.00-LS12.5]  109 10 270 top
SW21  TC-1212-7.3-160G  [KEY-TH_4P-L12.0-W12.0-P5.00-LS12.5]  109 78 270 top
SW22  PEC16-4220F-S0024  [SW-SMD_PEC16-4220F-S0024]  109 116 0 top
U1  6N138M  [DIP-8_L9.8-W6.6-P2.54-LS7.6-BL]  94.19 81.63 180 top
U2  SN74LS08N(LX)  [DIP-14_L19.1-W6.4-P2.54-LS7.6-BL]  19 78 180 top
U4  AMS1117-3.3V  [SOT-223-3_L6.5-W3.4-P2.30-LS7.0-BR]  40.98 140.44 0 top
U5  RPI-PICO-Ultimate  [RP-Pico-Ultimate-FP]  69 139 270 bottom
U6  2541FV-14P-B  [HDR-TH_14P-P2.54-V-F]  14 117.9 270 top
U7  DW254R-11-04-85  [HDR-TH_4P-P2.54-V-F]  94.99 117.9 270 top

## Footprints (pads in the part's own frame, mm; a bottom-side part is the same pattern mirrored in y, then rotated)
C0805
  rect 1.41x1.35 smd: 1(-1,0) 2(1,0)
C1210
  rect 1.635x2.7 smd: 1(-1.518,0) 2(1.518,0)
CAP-SMD_BD5.0-L5.3-W5.3-FD
  rect 2.8x1.1 smd: 1(-2.1,0) 2(2.1,0)
CONN-TH_2510-2AW
  round 1.6 hole 1.05: 1(1.27,0) 2(-1.27,0)
CONN-TH_KF2510-3AW
  round 1.6 hole 1.05: 1(-2.54,0) 2(0,0) 3(2.54,0)
DIP-8_L9.8-W6.6-P2.54-LS7.6-BL
  rect 1.5x1.5 hole 0.9: 1(-3.81,-3.81)
  round 1.5 hole 0.9: 2(-1.27,-3.81) 3(1.27,-3.81) 4(3.81,-3.81) 5(3.81,3.81) 6(1.27,3.81) 7(-1.27,3.81) 8(-3.81,3.81)
DIP-14_L19.1-W6.4-P2.54-LS7.6-BL
  rect 1.5x2 hole 1: 1(-7.62,-3.81)
  oval 1.5x2 hole 1: 2(-5.08,-3.81) 3(-2.54,-3.81) 4(0,-3.81) 5(2.54,-3.81) 6(5.08,-3.81) 7(7.62,-3.81) 8(7.62,3.81) 9(5.08,3.81) 10(2.54,3.81) 11(0,3.81) 12(-2.54,3.81) 13(-5.08,3.81) 14(-7.62,3.81)
HDR-TH_4P-P2.54-V-F
  rect 1.7x1.7 hole 1.1: 1(-3.81,0)
  round 1.7 hole 1.1: 2(-1.27,0) 3(1.27,0) 4(3.81,0)
HDR-TH_14P-P2.54-V-F
  rect 1.8x1.8 hole 1.2: 1(-16.51,0)
  round 1.8 hole 1.2: 2(-13.97,0) 3(-11.43,0) 4(-8.89,0) 5(-6.35,0) 6(-3.81,0) 7(-1.27,0) 8(1.27,0) 9(3.81,0) 10(6.35,0) 11(8.89,0) 12(11.43,0) 13(13.97,0) 14(16.51,0)
KEY-TH_4P-L12.0-W12.0-P5.00-LS12.5
  round 2.2 hole 1.5: 1(-6.251,2.54) 2(6.251,2.54) 3(-6.251,-2.54) 4(6.251,-2.54)
LED-TH_WS2812D-F8
  round 1 hole 0.6: 1(-1.9,0) 2(-0.633,0) 3(0.633,0) 4(1.9,0)
Pad_e23
  round 8 hole 3.2: 1(0,0)
Pad_e61
  round 8 hole 3.2: 1(0,0)
Pad_e62
  round 8 hole 3.2: 1(0,0)
Pad_e64
  round 8 hole 3.2: 1(0,0)
Pad_e65
  round 8 hole 3.2: 1(0,0)
Pad_e66
  round 8 hole 3.2: 1(0,0)
Pad_e67
  round 8 hole 3.2: 1(0,0)
Pad_e68
  round 8 hole 3.2: 1(0,0)
R1210
  rect 1.282x2.808 smd: 1(-1.441,0) 2(1.441,0)
RP-Pico-Ultimate-FP
  oval 1.6x2.25 hole 0.95: 1(-11.43,0) 2(-8.89,0) 3(-6.35,0) 4(-3.81,0) 5(-1.27,0) 6(1.27,0) 7(3.81,0) 8(6.35,0) 9(8.89,0) 10(11.43,0) 11(13.97,0) 12(16.51,0) 13(19.05,0) 14(21.59,0) 15(24.13,0) 16(26.67,0) 17(29.21,0) 18(31.75,0) 19(34.29,0) 20(36.83,0) 21(36.83,17.78) 22(34.29,17.78) 23(31.75,17.78) 24(29.21,17.78) 25(26.67,17.78) 26(24.13,17.78) 27(21.59,17.78) 28(19.05,17.78) 29(16.51,17.78) 30(13.97,17.78) 31(11.43,17.78) 32(8.89,17.78) 33(6.35,17.78) 34(3.81,17.78) 35(1.27,17.78) 36(-1.27,17.78) 37(-3.81,17.78) 38(-6.35,17.78) 39(-8.89,17.78) 40(-11.43,17.78)
SOD-123_L2.8-W1.8-LS3.7-RD-1
  rect 0.95x1.15 smd: 1(-1.692,0) 2(1.692,0)
SOT-223-3_L6.5-W3.4-P2.30-LS7.0-BR
  rect 2.5x1.1 smd: 1(2.97,-2.3) 2(2.97,0) 3(2.97,2.3)
  rect 2.34x3.6 smd: 4(-2.97,0)
SW-SMD_PEC16-4220F-S0024
  oval 3.2x3.5 hole 2.4x2.5: 6(-7.4,1.75) 6(7.4,1.75)
  round 2.5 hole 1.6: A(-5.08,-8.75) B(0,-8.75) C(5.08,-8.75) D(-2.54,8.75) E(2.54,8.75)

## Nets
+3V3REG: C18.1 U4.2 U4.4 U6.1 U6.4 U6.8
+3V3RP: R2.2 SW21.1 SW21.2 SW22.D U5.36
+5V: C1.2 C2.2 C3.2 C4.2 C5.2 C6.2 C7.2 C8.2 C9.2 C10.2 C11.2 C12.2 C13.2 C14.2 C15.2 C16.2 C17.1 C19.1 C20.1 LED1.2 LED2.2 LED3.2 LED4.2 LED5.2 LED6.2 LED7.2 LED8.2 LED9.2 LED10.2 LED11.2 LED12.2 LED13.2 LED14.2 LED15.2 LED16.2 R4.2 U1.8 U2.14 U4.3 U5.39
GND: C1.1 C2.1 C3.1 C4.1 C5.1 C6.1 C7.1 C8.1 C9.1 C10.1 C11.1 C12.1 C13.1 C14.1 C15.1 C16.1 C17.2 C18.2 C19.2 C20.2 CN1.2 LED1.3 LED2.3 LED3.3 LED4.3 LED5.3 LED6.3 LED7.3 LED8.3 LED9.3 LED10.3 LED11.3 LED12.3 LED13.3 LED14.3 LED15.3 LED16.3 NOREF.1 NOREF#2.1 NOREF#3.1 NOREF#4.1 NOREF#5.1 NOREF#6.1 NOREF#7.1 NOREF#8.1 R3.1 SW22.C U1.5 U2.7 U2.9 U2.10 U2.12 U2.13 U4.1 U5.6 U5.15 U5.35 U5.38 U6.2
$1I1196\$1N1042: LED1.1 LED2.4
$1I1196\$1N1196: LED3.1 LED4.4
$1I1196\$1N1203: LED2.1 LED3.4
$1I1196\$1N1505: LED5.1 LED6.4
$1I1196\$1N1507: LED4.1 LED5.4
$1I1196\$1N1662: LED7.1 LED8.4
$1I1196\$1N1664: LED6.1 LED7.4
$1I1196\$1N1824: LED8.1 LED9.4
$1I1196\$1N2179: LED9.1 LED10.4
$1I1196\$1N2250: LED10.1 LED11.4
$1I1196\$1N2321: LED11.1 LED12.4
$1I1196\$1N2587: LED12.1 LED13.4
$1I1196\$1N2589: LED15.1 LED16.4
$1I1196\$1N2600: LED14.1 LED15.4
$1I1196\$1N2605: LED13.1 LED14.4
$1I1530\$1N487: D1.1 R1.2 U1.2
$1I1530\$1N491: CN2.1 D1.2 U1.3
$1I1530\$1N587: R3.2 U1.7
$1I1530\$1N1256: CN2.2 R1.1
$1I1530\$1N1542: CN1.1 R4.1
$1I1530\$1N1548: CN1.3 R5.1
C1: SW1.1 SW1.2 SW5.1 SW5.2 SW9.1 SW9.2 SW13.1 SW13.2 SW17.1 SW17.2 U5.19
C2: SW2.1 SW2.2 SW6.1 SW6.2 SW10.1 SW10.2 SW14.1 SW14.2 SW18.1 SW18.2 U5.18
C3: SW3.1 SW3.2 SW7.1 SW7.2 SW11.1 SW11.2 SW15.1 SW15.2 SW19.1 SW19.2 U5.21
C4: SW4.1 SW4.2 SW8.1 SW8.2 SW12.1 SW12.2 SW16.1 SW16.2 SW20.1 SW20.2 U5.20
ENC_A: SW22.A U5.9
ENC_B: SW22.B U5.10
MIDI_RX: R2.1 U1.6 U5.7
MIDI_TX: U2.1 U2.2 U5.23
R1: SW1.3 SW1.4 SW2.3 SW2.4 SW3.3 SW3.4 SW4.3 SW4.4 U5.16
R2: SW5.3 SW5.4 SW6.3 SW6.4 SW7.3 SW7.4 SW8.3 SW8.4 U5.14
R3: SW9.3 SW9.4 SW10.3 SW10.4 SW11.3 SW11.4 SW12.3 SW12.4 U5.13
R4: SW13.3 SW13.4 SW14.3 SW14.4 SW15.3 SW15.4 SW16.3 SW16.4 U5.12
R5: SW17.3 SW17.4 SW18.3 SW18.4 SW19.3 SW19.4 SW20.3 SW20.4 U5.11
SC_CS: U5.25 U6.3
SC_DC: U5.24 U6.5
SC_MISO: U5.32 U6.9
SC_MOSI: U5.31 U6.6
SC_SCK: U5.30 U6.7
SD_CS: U5.2 U7.1
SD_MISO: U5.1 U7.3
SD_MOSI: U5.4 U7.2
SD_SCK: U5.3 U7.4
SW_EN: SW22.E U5.8
SW_EX: SW21.3 SW21.4 U5.17
WS2812: U2.4 U2.5 U5.22
$1N1917: R5.2 U2.3
$1N1929: LED1.4 U2.6

Pads without a net: LED16 1; SW22 6; U1 1 4; U2 8 11; U5 5 26 27 28 29 33 34 37 40; U6 10 11 12 13 14

## Via types
v1: diameter 1.27, hole 0.635, Top Layer to Bottom Layer, 37 vias
v2: diameter 0.762, hole 0.381, Top Layer to Bottom Layer, 24 vias

## Routing (per net, layer and track width the routed paths; a pad name or vN(x,y) marks a point on that pad's centre or on a via; arc(x,y) is an arc through that point)
+3V3REG: length 86.7
  Top Layer w1.27: 13.99,126.78 15.25,126.78 ; 15.25,126.78 16.39,127.92 16.39,136.8 ; 15.25,126.78 15.88,126.78 16.45,126.21 16.45,117.26 15.81,116.62 13.99,116.62 ; 16.39,136.8 29.27,149.67 32.56,149.67 38.14,144.09 38.14,140.44 38.32,140.26 38.32,133.71 40.31,131.72 44.8,131.72 46.31,133.23 46.31,139.54 45.41,140.44 43.81,140.44 ; 16.39,136.8 16.39,136.8 U6.1
+3V3RP: length 180.2
  Top Layer w0.762: SW21.2 SW21.1
  Top Layer w1.27: SW21.1 111.54,91.35 107.84,95.05 107.84,98.98 111.54,102.68 111.54,119.67 SW22.D ; v1(58.27,89.9) 58.27,136.82 54.81,140.27 U5.36 ; R2.2 82.25,89.91 v1(82.24,89.9)
  Bottom Layer w1.27: SW21.1 105.89,89.9 v1(58.27,89.9)
+5V: length 582.7
  Top Layer w0.762: LED9.2 108.37,29.03 107.06,30.33 107.06,30.42 C9.2 ; LED8.2 109.63,63.42 108.52,64.54 ; LED16.2 10.37,24 10.37,24.69 11.48,25.8 11.48,30.48 ; C1.2 14.52,60.88 12.89,59.26 12.38,59.26 11.64,58.52 11.64,58 LED1.2
  Top Layer w0.889: LED3.2 39.63,65.12 C3.2 ; C6.2 81.63,65.12 LED6.2 ; C7.2 95.63,65.12 LED7.2 ; C13.2 52.37,31.12 LED13.2 ; C10.2 94.37,31.12 LED10.2 ; C2.2 25.63,65.12 LED2.2 ; LED4.2 53.63,65.12 C4.2 ; LED14.2 38.37,31.12 C14.2 ; LED11.2 80.37,31.12 C11.2 ; C15.2 24.37,31.12 LED15.2 ; LED12.2 66.37,31.12 C12.2 ; C5.2 67.63,65.12 LED5.2
  Top Layer w1.016: v1(99.41,63.14) 99.41,70.41 99.44,70.43 99.44,73.87 99.41,73.89 99.41,76.4 U1.8
  Top Layer w1.27: C2.2 29.37,63.14 v1(29.41,63.14) ; v1(85.41,63.14) 85.37,63.14 C6.2 ; v1(71.41,63.14) 71.37,63.14 C5.2 ; C10.2 90.63,29.15 v1(90.63,29.11) ; C7.2 99.37,63.14 v1(99.41,63.14) ; C14.2 34.63,29.15 ; C16.2 11.48,30.48 v1(10.11,29.11) ; C15.2 20.63,29.15 20.63,34.82 17.41,38.03 v1(17.41,63.14) 17.37,63.14 C1.2 18.03,66 23.21,71.18 23.82,71.18 25.85,73.21 25.85,73.42 U2.14 30.73,78.3 v1(30.73,147.99) ; 43.81,142.74 43.81,147.04 43.17,147.68 51.01,147.68 U5.39 ; C4.2 57.37,63.14 v1(57.41,63.14) ; v1(102.63,29.11) 102.63,29.15 C9.2 ; v1(107.12,63.14) 108.52,64.54 C8.2 ; C19.1 8.13,79.02 v1(8.13,81.28) ; U1.8 98,77.6 C20.1 ; v1(43.51,63.14) 43.47,63.14 40.62,66 ; v1(76.63,29.11) 76.63,29.15 C11.2 ; v1(48.63,29.11) 48.63,29.15 C13.2 ; v1(62.63,29.11) 62.63,29.15 C12.2
  Bottom Layer w1.27: v1(102.63,29.11) v1(90.63,29.11) v1(76.63,29.11) v1(62.63,29.11) v1(48.63,29.11) v1(34.63,29.11) v1(20.63,29.11) v1(10.11,29.11) ; U2.14 26.62,74.4 24.81,76.21 13.21,76.21 v1(8.13,81.28) ; U5.39 51.12,147.99 v1(30.73,147.99) ; v1(107.12,63.14) v1(99.41,63.14) v1(85.41,63.14) v1(71.41,63.14) v1(57.41,63.14) v1(43.51,63.14) v1(29.41,63.14) v1(17.41,63.14)
GND: length 884.8
  Top Layer w0.762: LED16.3 11.64,24 11.64,24.52 12.38,25.26 12.89,25.26 14.52,26.88 14.52,31.51 ; LED8.3 108.37,59.18 105.48,62.06 C8.1 ; C9.1 109.22,31.3 109.22,29.61 109.63,29.2 LED9.3 ; LED1.3 10.37,58 10.37,58.69 11.48,59.8 C1.1
  Top Layer w0.889: C13.1 53.63,31.12 LED13.3 ; C4.1 52.37,65.12 LED4.3 ; C15.1 25.63,31.12 LED15.3 ; C3.1 38.37,65.12 LED3.3 ; LED5.3 66.37,65.12 C5.1 ; C10.1 95.63,31.12 LED10.3 ; C12.1 67.63,31.12 LED12.3 ; C11.1 81.63,31.12 LED11.3 ; LED14.3 39.63,31.12 C14.1 ; LED7.3 94.37,65.12 C7.1 ; LED2.3 24.37,65.12 C2.1 ; C6.1 80.37,65.12 LED6.3
  Top Layer w1.27: C11.1 v1(82.52,34.8) ; C5.1 v1(65.48,69.29) ; C13.1 v1(54.52,34.8) ; C9.1 v1(108.52,34.8) ; U1.5 90.38,77.81 C20.2 93.48,74.7 v1(93.48,69.29) ; NOREF#3.1 115,96 NOREF#6.1 114,116.3 113.78,116.52 113.78,118.98 114,119.2 NOREF#8.1 ; C2.1 v1(23.48,69.29) ; C14.1 v1(40.52,34.8) ; C7.1 v1(93.48,69.29) ; v1(93.48,69.29) 95.18,69.29 R3.1 ; C6.1 v1(79.48,69.29) ; 41.69,139.58 41.69,144.37 38.37,147.68 ; 41.69,139.58 41.69,138.6 v1(40.82,137.74) ; 41.69,139.58 43.13,138.14 43.81,138.14 43.12,137.45 43.12,133.71 ; U5.6 71.07,137.73 72.75,136.05 72.75,117.29 70.33,114.87 U5.15 ; C15.1 v1(26.52,34.8) ; C8.1 v1(105.48,69.29) ; C3.1 v1(37.48,69.29) ; C4.1 v1(51.48,69.29) ; U2.9 13.92,71.73 v1(11.48,69.29) C1.1 ; U5.35 49.91,137.73 48.58,139.06 48.58,144.62 49.3,145.35 U5.38 ; v1(14.52,34.8) C16.1 14.52,31.51 ; U2.7 11.38,79.63 8.72,76.96 C19.2 8.08,69.08 NOREF#2.1 NOREF#7.1 ; C12.1 v1(68.52,34.8) ; NOREF.1 NOREF#4.1 ; C10.1 v1(96.52,34.8)
  Bottom Layer w0.762: v1(40.82,137.74) 40.82,137.73
  Bottom Layer w1.27: NOREF#3.1 111.71,69.29 v1(105.48,69.29) v1(93.48,69.29) v1(79.48,69.29) v1(65.48,69.29) v1(51.48,69.29) v1(37.48,69.29) v1(23.48,69.29) v1(11.48,69.29) 8.19,66 NOREF#2.1 ; NOREF#8.1 112.73,137.73 U5.6 ; U2.13 U2.12 20.77,73.42 20.77,73.21 19.73,72.17 18.27,72.17 17.23,73.21 17.23,73.42 U2.10 U2.9 ; 33.26,97 NOREF.1 ; 33.26,97 NOREF#6.1 ; 33.26,97 CN1.2 ; 13.99,131.86 9.2,131.86 8.31,132.76 8.31,136.69 7.27,137.73 U5.35 ; NOREF#7.1 7.8,34.8 v1(14.52,34.8) v1(26.52,34.8) v1(40.52,34.8) v1(54.52,34.8) v1(68.52,34.8) v1(82.52,34.8) v1(96.52,34.8) v1(108.52,34.8) 112.2,34.8 NOREF#5.1
$1I1196\$1N1042: length 10.2
  Bottom Layer w0.762: LED1.1 LED2.4
$1I1196\$1N1196: length 10.2
  Bottom Layer w0.762: LED3.1 LED4.4
$1I1196\$1N1203: length 10.2
  Bottom Layer w0.762: LED2.1 LED3.4
$1I1196\$1N1505: length 10.2
  Bottom Layer w0.762: LED5.1 LED6.4
$1I1196\$1N1507: length 10.2
  Bottom Layer w0.762: LED4.1 LED5.4
$1I1196\$1N1662: length 10.2
  Bottom Layer w0.762: LED7.1 LED8.4
$1I1196\$1N1664: length 10.2
  Bottom Layer w0.762: LED6.1 LED7.4
$1I1196\$1N1824: length 35
  Top Layer w0.762: LED8.1 110.9,52.24 109.68,51.02 109.68,36.5 109.79,36.39 109.79,34.81 110.24,34.36 110.24,30.03 110.9,29.37 LED9.4
$1I1196\$1N2179: length 10.2
  Bottom Layer w0.762: LED10.4 LED9.1
$1I1196\$1N2250: length 10.2
  Bottom Layer w0.762: LED11.4 LED10.1
$1I1196\$1N2321: length 10.2
  Bottom Layer w0.762: LED12.4 LED11.1
$1I1196\$1N2587: length 10.2
  Bottom Layer w0.762: LED13.4 LED12.1
$1I1196\$1N2589: length 10.2
  Bottom Layer w0.762: LED15.1 LED16.4
$1I1196\$1N2600: length 10.2
  Bottom Layer w0.762: LED15.4 LED14.1
$1I1196\$1N2605: length 10.2
  Bottom Layer w0.762: LED14.4 LED13.1
$1I1530\$1N487: length 8.1
  Top Layer w0.762: R1.2 95.71,92.86 D1.1 95.71,85.69 95.46,85.44
$1I1530\$1N491: length 17.2
  Top Layer w0.762: CN2.1 93.94,98.39 93.94,91.41 92.32,89.8 92.32,86.03 U1.3
$1I1530\$1N587: length 11.9
  Top Layer w0.762: R3.2 100.92,77.04 98.62,79.33 96.97,79.33 95.46,77.82
$1I1530\$1N1256: length 8.9
  Top Layer w0.762: CN2.2 89.05,96.64 R1.1
$1I1530\$1N1542: length 11
  Top Layer w1.27: CN1.1 34.46,90.94 R4.1
$1I1530\$1N1548: length 18.7
  Top Layer w0.762: v2(24.5,102.57) 24.5,99.7 R5.1
  Bottom Layer w0.762: v2(24.5,102.57) 37.7,102.57 CN1.3
C1: length 214.3
  Top Layer w0.762: SW17.2 SW17.1 ; SW13.2 SW13.1 ; SW5.2 SW5.1 ; SW9.2 SW9.1 ; 69.74,71.73 72.95,68.51 72.95,53.34 69.85,50.23 ; 13.85,16.22 16.7,19.07 16.7,34.75 13.74,37.71 ; SW1.2 SW1.1 69.65,90.01 70.89,91.25 70.89,102.82 69.65,104.05 69.65,104.06 U5.19 ; 69.7,16.16 72.55,19.02 72.55,34.7 69.59,37.66
  Bottom Layer w0.762: SW17.1 69.54,15.95 67.52,13.93 15.79,13.93 13.54,16.18 SW13.1
C2: length 230.1
  Top Layer w0.762: 27.56,37.71 30.53,34.75 30.53,19.07 27.67,16.22 ; 83.63,50.27 87.13,53.78 87.13,68.16 83.52,71.77 ; SW6.2 SW6.1 ; v2(83.65,107.24) SW2.1 SW2.2 ; 83.56,3.77 83.56,16.27 ; SW10.2 SW10.1 ; 83.72,16.11 86.57,18.97 86.57,34.65 83.61,37.61 ; SW14.2 SW14.1
  Bottom Layer w0.762: U5.18 69.01,107.24 v2(83.65,107.24) ; 83.56,3.77 81.55,5.79 29.58,5.79 27.56,3.77
C3: length 213.5
  Top Layer w0.762: 97.69,16.16 99.27,17.74 99.27,35.98 97.58,37.66 ; SW11.2 SW11.1 ; 41.64,37.61 44.6,34.65 44.6,18.97 41.75,16.11 ; U5.21 51.22,94.04 SW3.1 SW3.2 45.41,67.76 45.41,54.12 SW7.1 SW7.2 ; SW19.2 SW19.1 ; SW15.2 SW15.1
  Bottom Layer w0.762: SW15.2 47.83,3.75 49.69,1.89 93.23,1.89 95.09,3.75 SW19.2
C4: length 228.1
  Top Layer w0.762: SW20.2 SW20.1 101,26.79 101,38.59 v2(102.18,39.76) ; SW12.2 SW12.1 ; 55.61,37.61 58.57,34.65 58.57,18.97 55.72,16.11 ; v2(55.43,102.19) SW4.1 SW4.2 ; 55.63,50.19 58.72,53.29 58.72,68.48 55.52,71.69 ; SW16.2 SW16.1
  Bottom Layer w0.762: U5.20 68.98,102.19 v2(55.43,102.19) ; SW8.1 SW8.2 57.56,39.76 v2(102.18,39.76) 109.52,39.76 SW12.2
ENC_A: length 54.4
  Top Layer w0.762: SW22.A 98,113.17 v2(98,130.14)
  Bottom Layer w0.762: U5.9 97.97,130.11 v2(98,130.14)
ENC_B: length 57.7
  Top Layer w0.762: SW22.B 102.52,113.73 102.52,115.18 103.96,116.62 103.96,118.88 102.52,120.32 v2(102.52,127.57)
  Bottom Layer w0.762: U5.10 v2(102.52,127.57)
MIDI_RX: length 76.7
  Top Layer w0.762: v2(85.13,135.19) R2.1 85.13,85.6 U1.6
  Bottom Layer w0.762: v2(85.13,135.19) 85.13,135.19 U5.7
MIDI_TX: length 52.6
  Top Layer w0.762: U2.1 v2(26.62,107.24)
  Bottom Layer w0.762: U2.1 U2.2 ; v2(26.62,107.24) 51.21,107.24 U5.23
R1: length 134.5
  Top Layer w0.762: SW2.4 SW2.3 v2(78.57,112.34) ; SW3.4 SW3.3 ; SW4.4 SW4.3 ; SW1.4 SW1.3
  Bottom Layer w0.762: v2(78.57,112.34) 78.56,112.33 U5.16 ; SW3.3 38.8,84.25 40.66,86.11 42.2,86.11 44.06,84.25 SW4.3 52.8,84.25 54.66,86.11 56.2,86.11 58.06,84.25 SW1.3 67.02,84.25 68.88,86.11 70.42,86.11 72.28,84.25 SW2.3
R2: length 182.6
  Top Layer w0.762: SW5.4 SW5.3 ; SW6.4 SW6.3 ; SW7.4 SW7.3 ; v2(53.37,117.39) 53.37,91.58 48.07,86.28 48.07,52.64 SW8.3 SW8.4
  Bottom Layer w0.762: SW5.3 10.91,50.25 12.77,52.11 14.31,52.11 16.17,50.25 SW6.3 24.91,50.25 26.77,52.11 28.31,52.11 30.17,50.25 SW7.3 ; U5.14 68.98,117.39 v2(53.37,117.39) ; 50.48,50.26 44.19,50.26 42.33,52.12 40.68,52.12 38.82,50.26 36.48,50.26
R3: length 172.3
  Top Layer w0.762: SW12.4 SW12.3 ; SW9.4 SW9.3 64.46,56.86 62.71,58.61 62.71,85.02 64.46,86.77 v2(64.46,119.94) ; SW11.4 SW11.3 ; SW10.4 SW10.3
  Bottom Layer w0.762: SW12.3 100.17,50.25 98.31,52.11 96.77,52.11 94.91,50.25 SW11.3 86.21,50.25 ; 78.5,50.26 80.9,50.26 82.76,52.12 84.35,52.12 86.21,50.26 ; v2(64.46,119.94) 68.99,119.94 U5.13 ; SW9.3 66.91,50.25 68.77,52.11 70.31,52.11 72.17,50.25 SW10.3
R4: length 218.9
  Top Layer w0.762: SW13.4 SW13.3 ; SW14.4 SW14.3 ; SW16.4 SW16.3 50.46,19.32 46.84,22.94 46.84,30.61 52.4,36.17 52.4,37.24 59.85,44.69 59.85,122.44 v2(59.8,122.49) ; SW15.4 SW15.3
  Bottom Layer w0.762: 50.48,16.29 44.25,16.29 42.39,18.15 40.78,18.15 38.92,16.29 30.22,16.29 28.35,18.15 26.81,18.15 24.95,16.29 16.24,16.29 14.38,18.15 12.81,18.15 10.95,16.29 8.53,16.29 ; U5.12 69,122.49 v2(59.8,122.49)
R5: length 214.6
  Top Layer w0.762: SW17.4 SW17.3 61.02,19.69 61.02,124.48 v2(61.48,124.94) ; SW19.4 SW19.3 ; SW18.4 SW18.3 ; SW20.4 SW20.3
  Bottom Layer w0.762: 78.47,16.29 72.19,16.29 70.33,18.15 68.78,18.15 66.92,16.29 64.47,16.29 ; 106.42,16.29 100.14,16.29 98.28,18.15 96.73,18.15 94.87,16.29 86.21,16.29 ; v2(61.48,124.94) 68.91,124.94 U5.11 ; 86.21,16.24 84.16,18.29 83,18.29 82.82,18.11 82.77,18.11 80.9,16.24 78.5,16.24
SC_CS: length 48.6
  Top Layer w0.762: U5.25 43.85,119.7 v2(43.85,127.09)
  Bottom Layer w0.762: v2(43.85,127.09) 39.78,127.09 37.56,129.32 13.99,129.32
SC_DC: length 49.2
  Top Layer w0.762: v2(39.83,124.24) 39.83,114.88 41.8,112.91 42.64,112.91 43.24,113.51 47.5,113.51 U5.24
  Bottom Layer w0.762: 13.99,124.24 v2(39.83,124.24)
SC_MISO: length 52.5
  Top Layer w0.762: v2(42.22,113.93) 42.22,128.52 43.81,130.11 U5.32
  Bottom Layer w0.762: v2(42.22,113.93) 14.15,113.93 13.99,114.08
SC_MOSI: length 39.7
  Top Layer w0.762: v2(45.22,121.7) 51.09,127.57 U5.31
  Bottom Layer w0.762: 13.99,121.7 v2(45.22,121.7)
SC_SCK: length 40.3
  Top Layer w0.762: v2(46.44,119.16) 46.44,120.25 U5.30
  Bottom Layer w0.762: 13.99,119.16 v2(46.44,119.16)
SD_CS: length 52.1
  Top Layer w0.762: 95,121.7 94.85,121.85 v2(94.85,147.89)
  Bottom Layer w0.762: U5.2 v2(94.85,147.89)
SD_MISO: length 57.7
  Top Layer w0.762: 95,116.62 91.34,120.28 v2(91.34,150.43)
  Bottom Layer w0.762: U5.1 v2(91.34,150.43)
SD_MOSI: length 48.7
  Top Layer w0.762: v2(93.02,142.79) 93.02,120.8 93.78,120.04 94.12,120.04 95,119.16
  Bottom Layer w0.762: v2(93.02,142.79) 93,142.81 U5.4
SD_SCK: length 52.3
  Top Layer w0.762: 95,114.08 86.47,122.61 v2(86.47,145.35)
  Bottom Layer w0.762: U5.3 v2(86.47,145.35)
SW_EN: length 45.8
  Bottom Layer w0.762: SW22.E 103.64,132.65 U5.8
SW_EX: length 70.5
  Top Layer w0.762: v2(98,109.79) 98,92.71 SW21.3 SW21.4
  Bottom Layer w0.762: U5.17 v2(98,109.79)
WS2812: length 57.8
  Top Layer w0.762: U2.4 v2(19,104.84)
  Bottom Layer w0.762: v2(19,104.84) 51.09,104.84 U5.22 ; U2.5 U2.4
$1N1917: length 17.9
  Top Layer w0.762: U2.3 21.54,99.62 R5.2
$1N1929: length 25.8
  Top Layer w0.762: LED1.4 9.11,58 9.11,59.93 9.87,60.69 9.87,75.07 13.92,79.12 U2.6

## Copper pours and planes (outline as drawn; the poured copper is in the pictures)
GND on Top Layer: 0,152 120,152 120,0 0,0
GND on Bottom Layer: 0,152 120,152 120,0 0,0

## Text on the board
Bottom Silkscreen Layer: 4 2 5 | 4 5
Top Layer: Lucas / Gutierrez | FACET-UNT / 2025 | v1
